# EAGLE schematic Tommy (EAGLE 6.3)
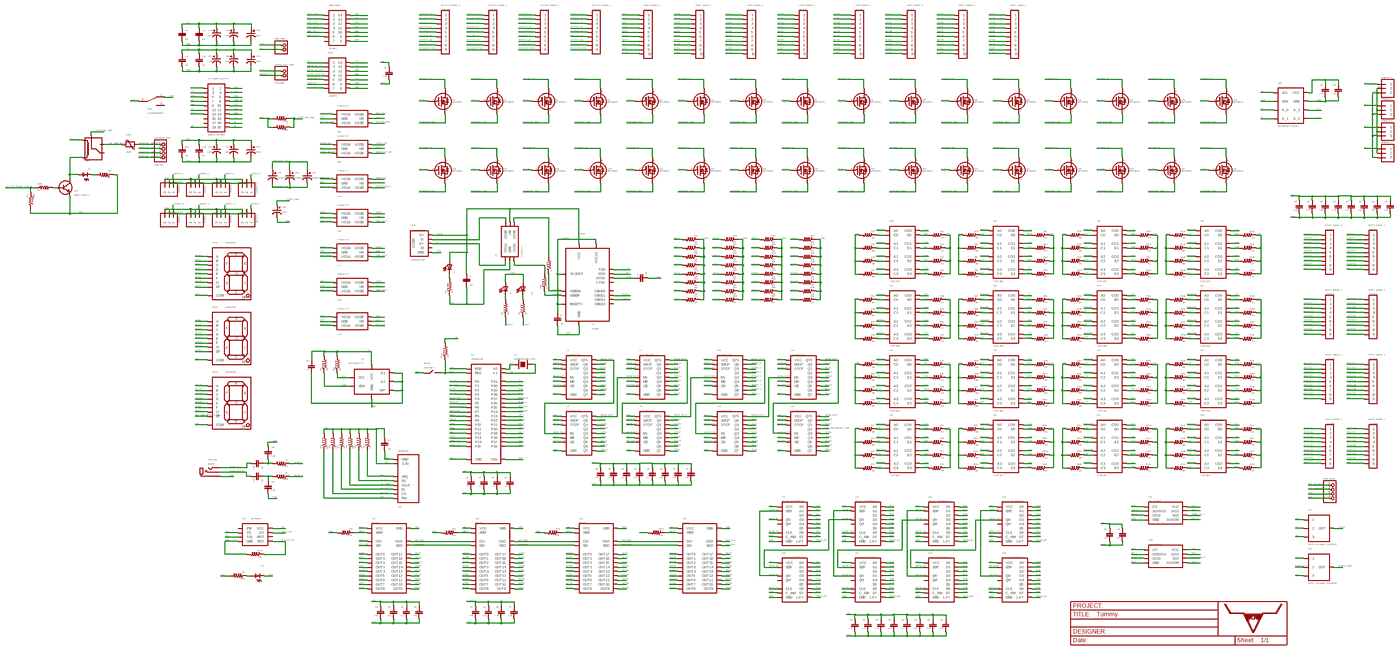
[diagram p0: schematic, sheet 1, overview]
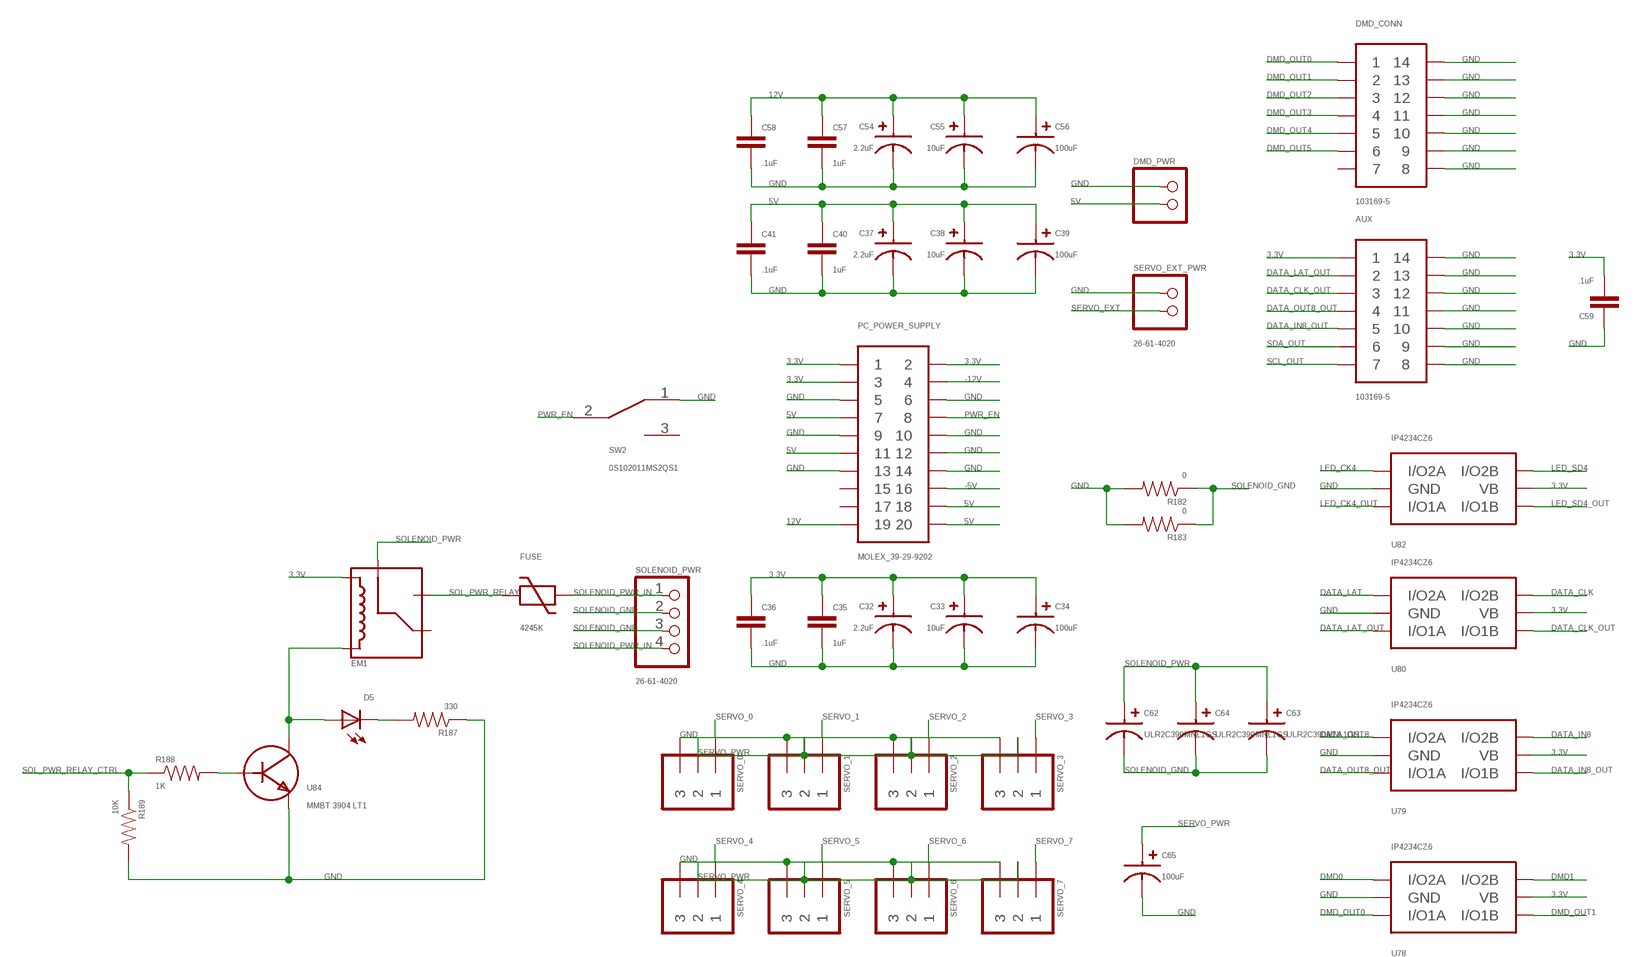
[diagram p1: schematic, sheet 1, part 1 of 9]
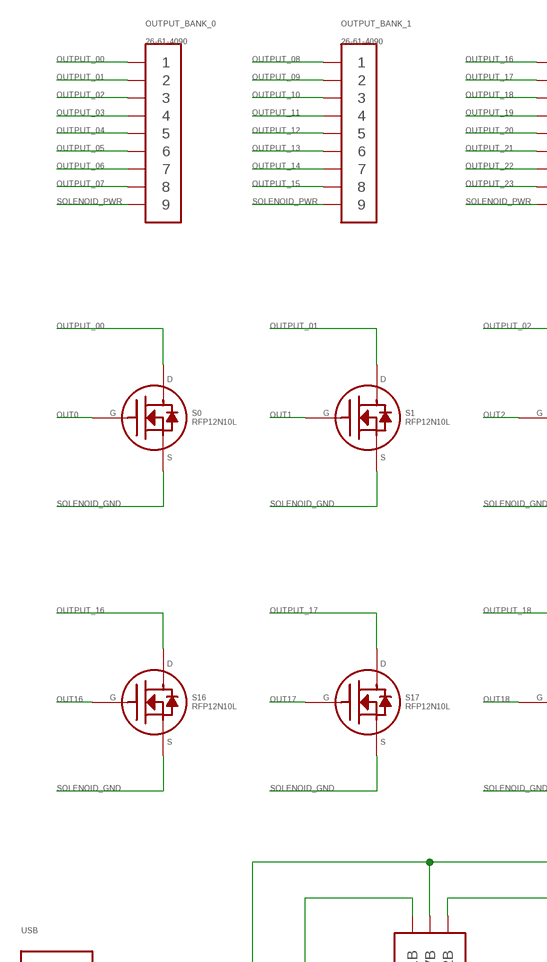
[diagram p2: schematic, sheet 1, part 2 of 9]
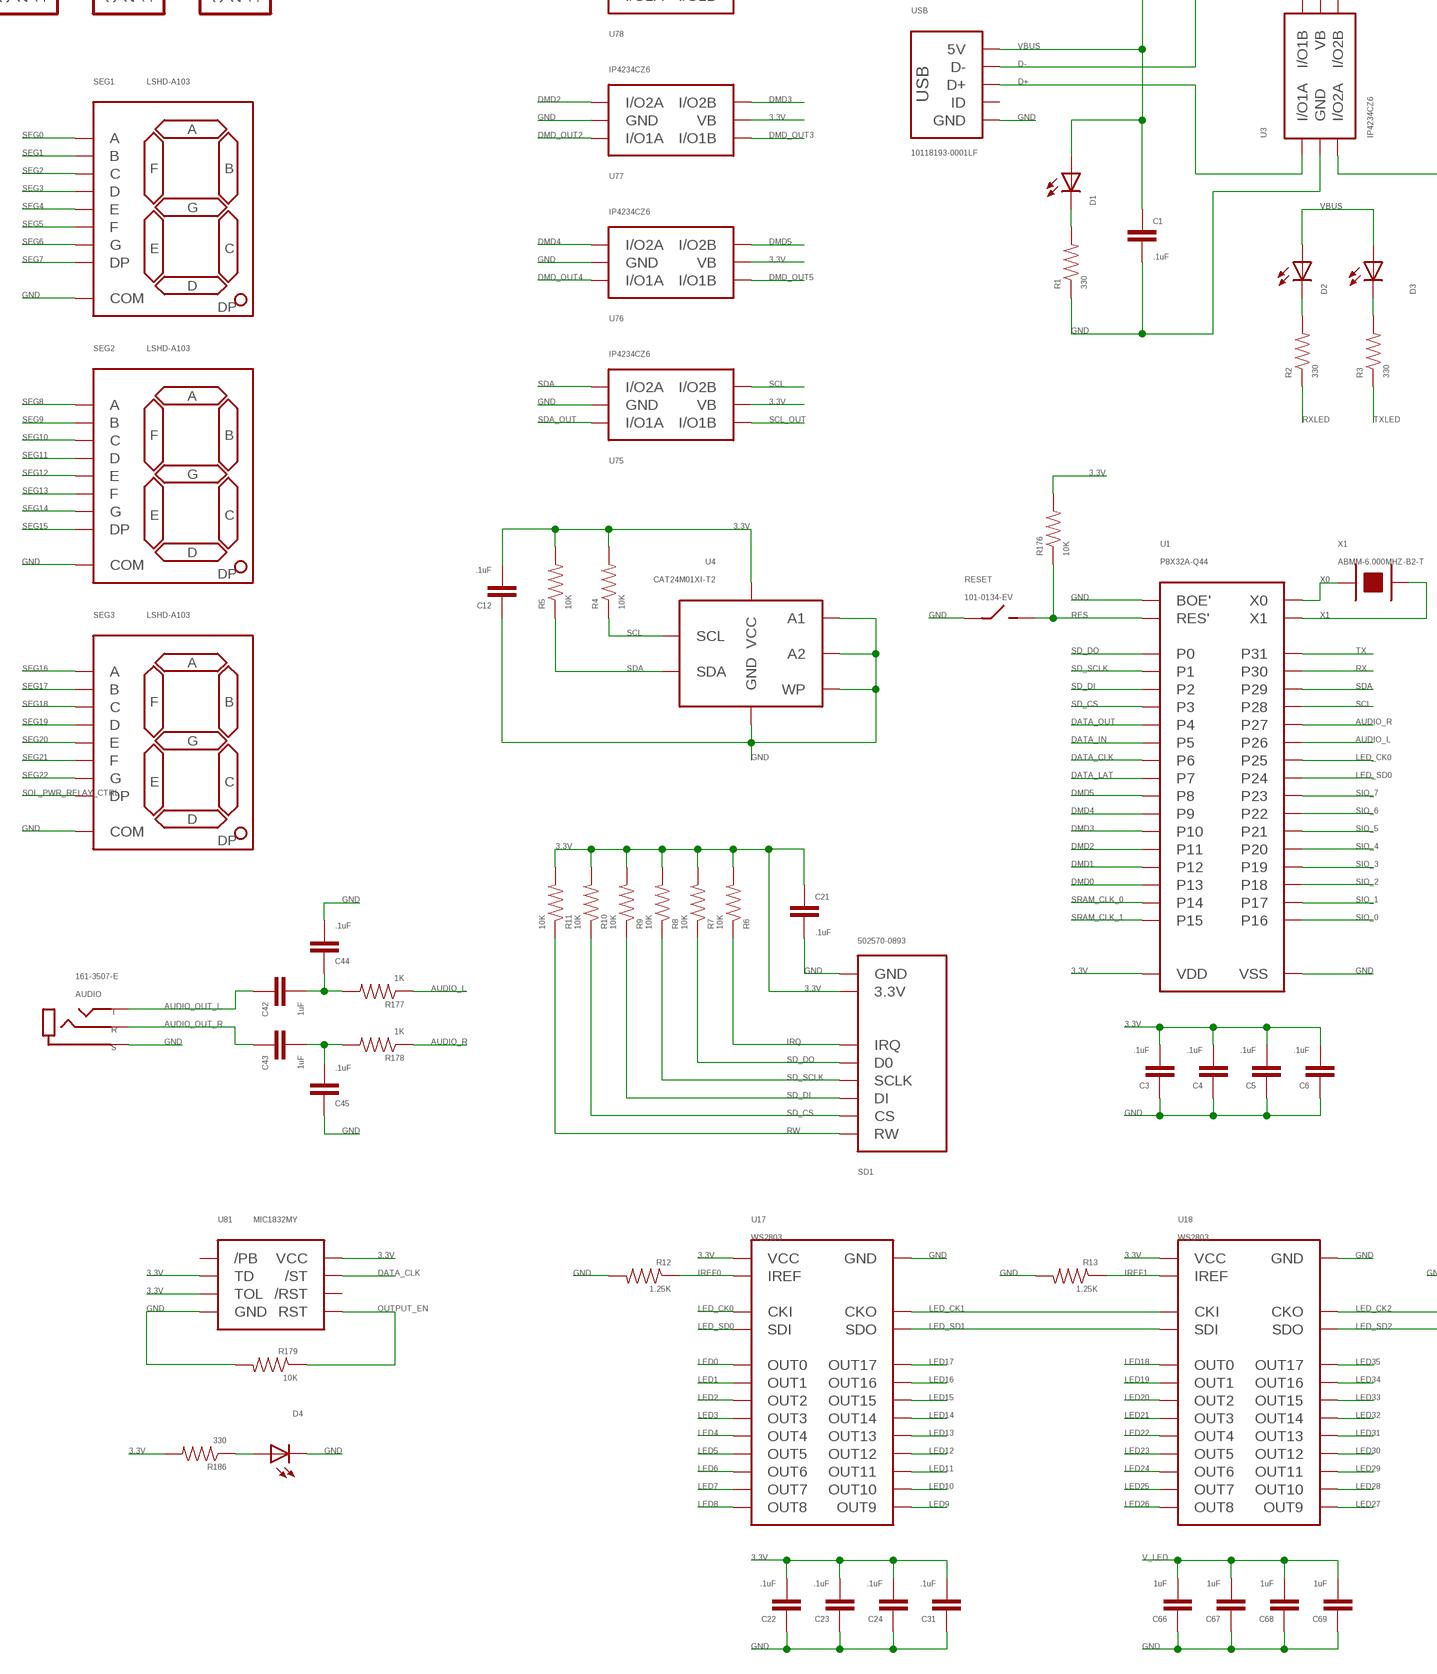
[diagram p3: schematic, sheet 1, part 3 of 9]
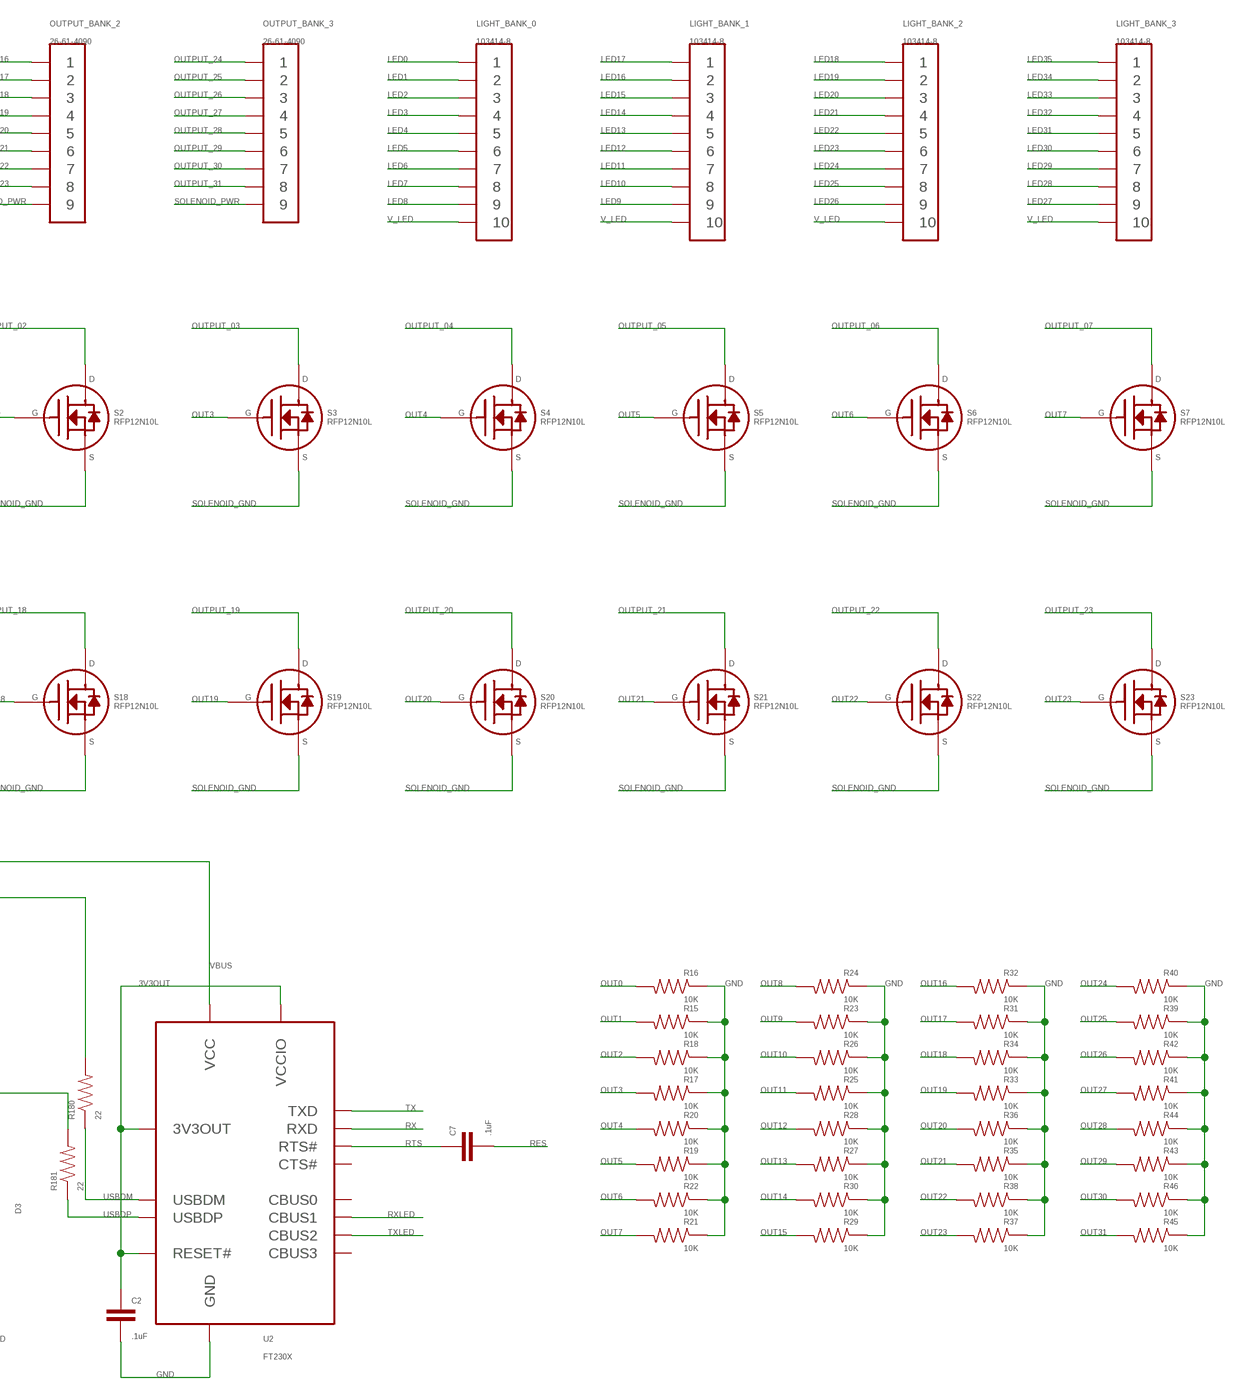
[diagram p4: schematic, sheet 1, part 4 of 9]
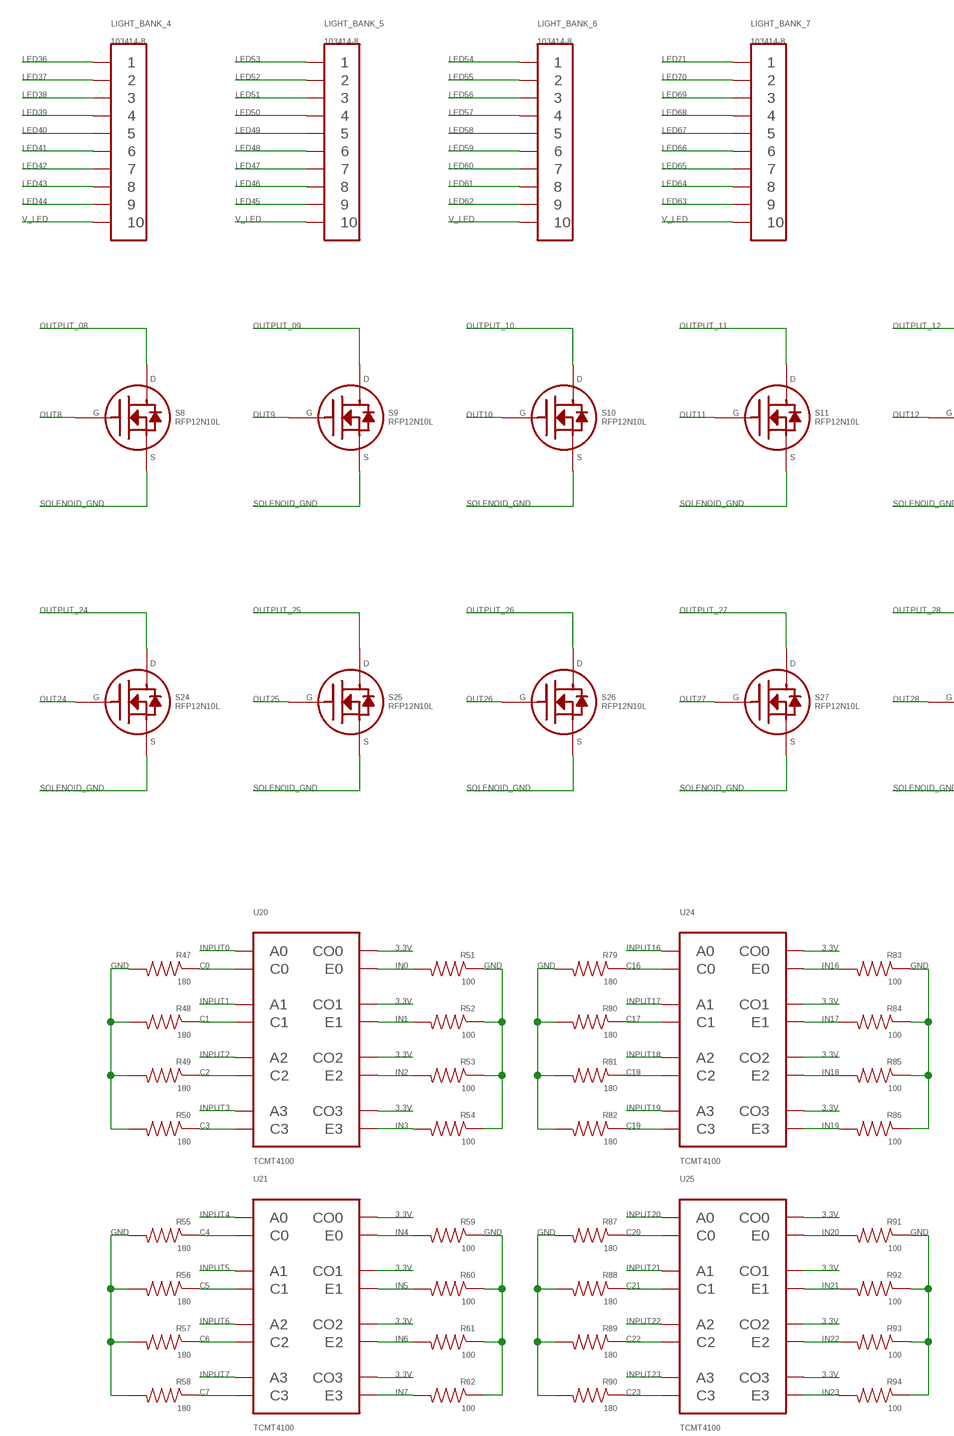
[diagram p5: schematic, sheet 1, part 5 of 9]
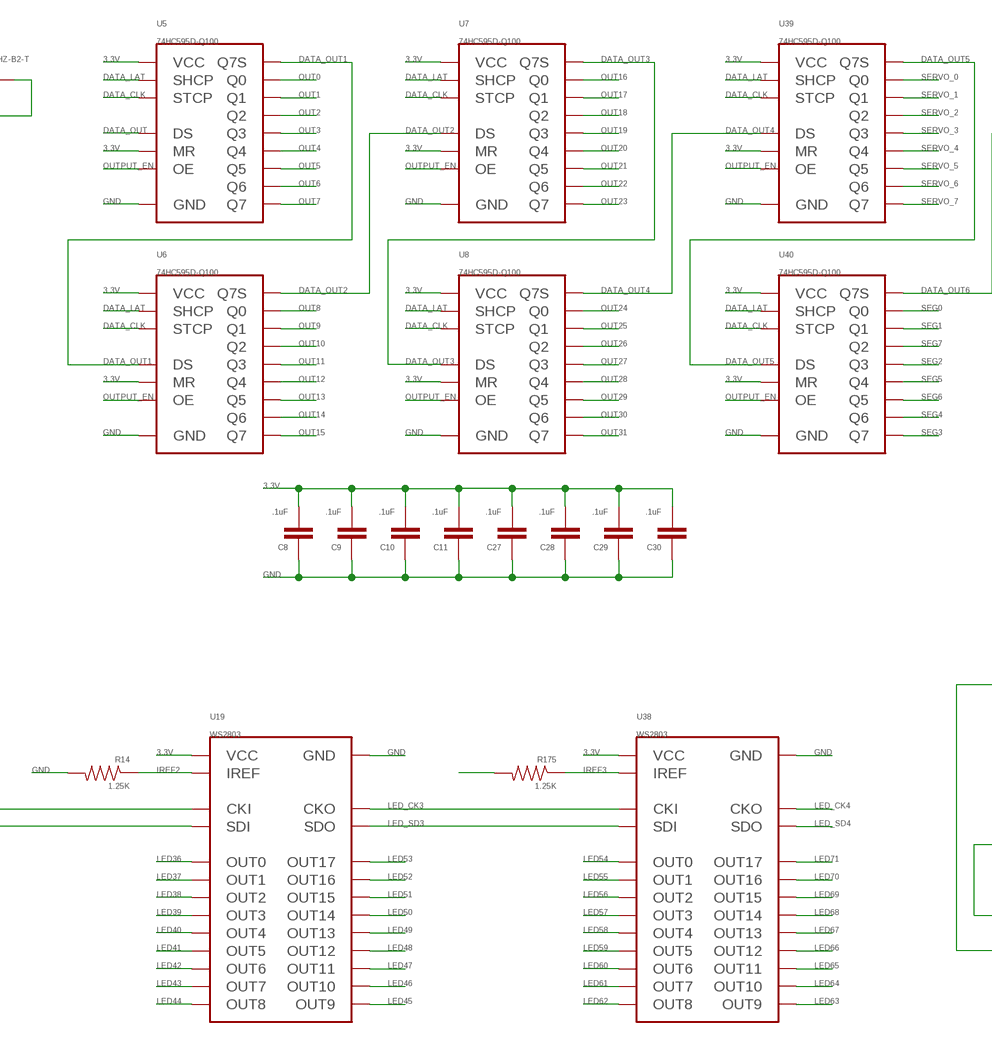
[diagram p6: schematic, sheet 1, part 6 of 9]
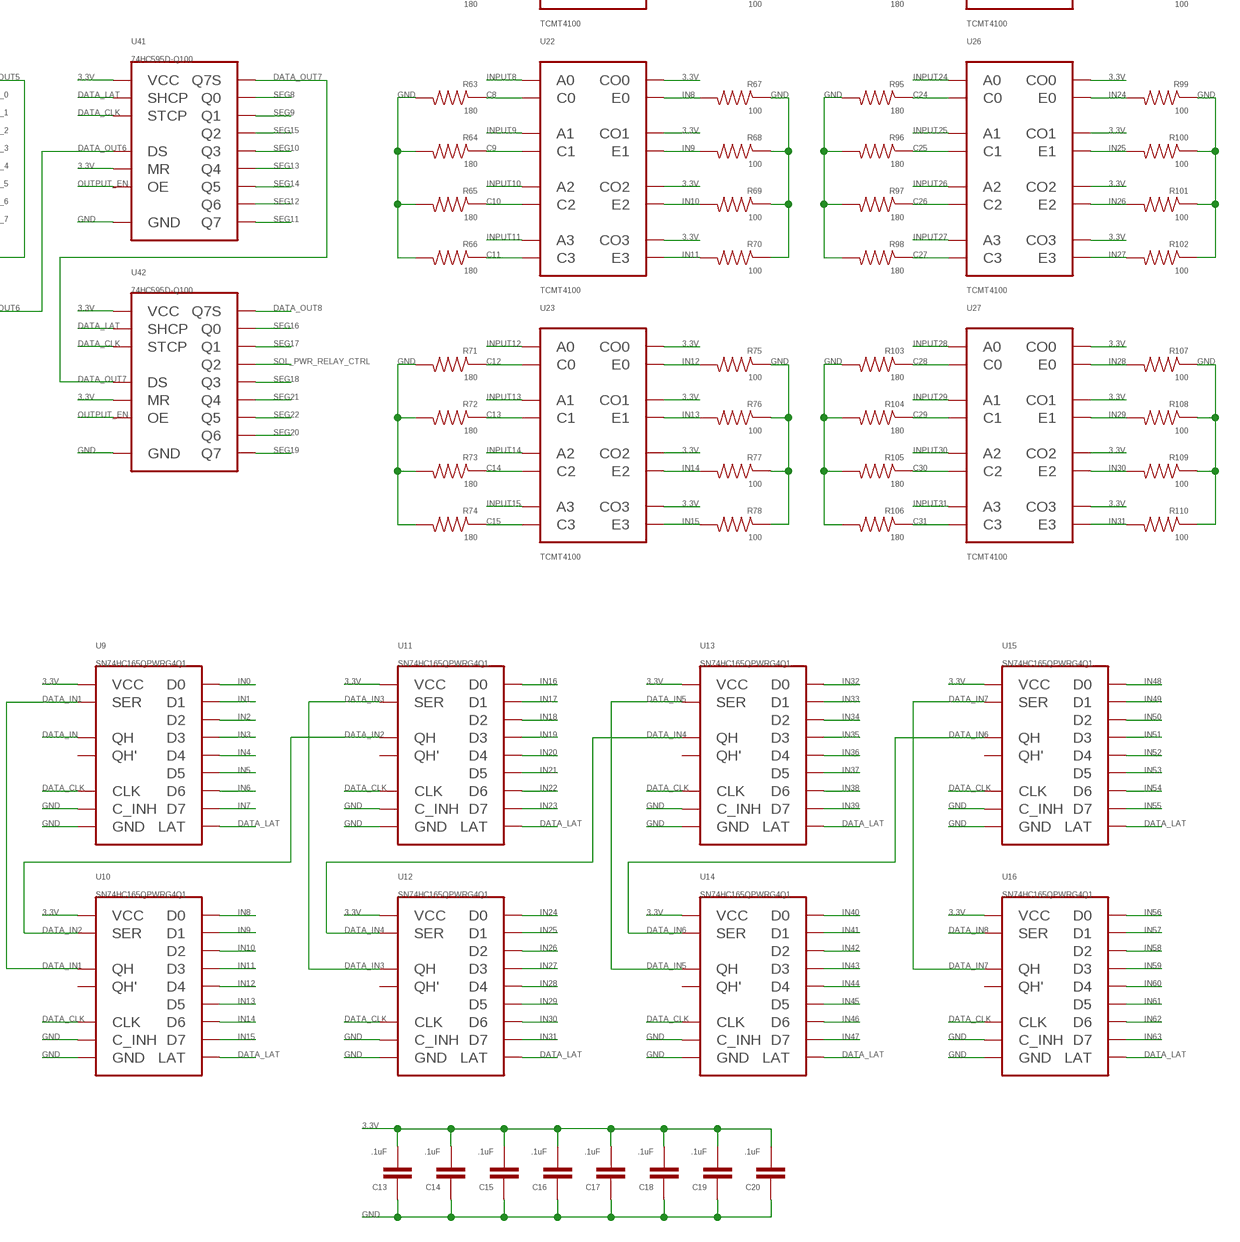
[diagram p7: schematic, sheet 1, part 7 of 9]
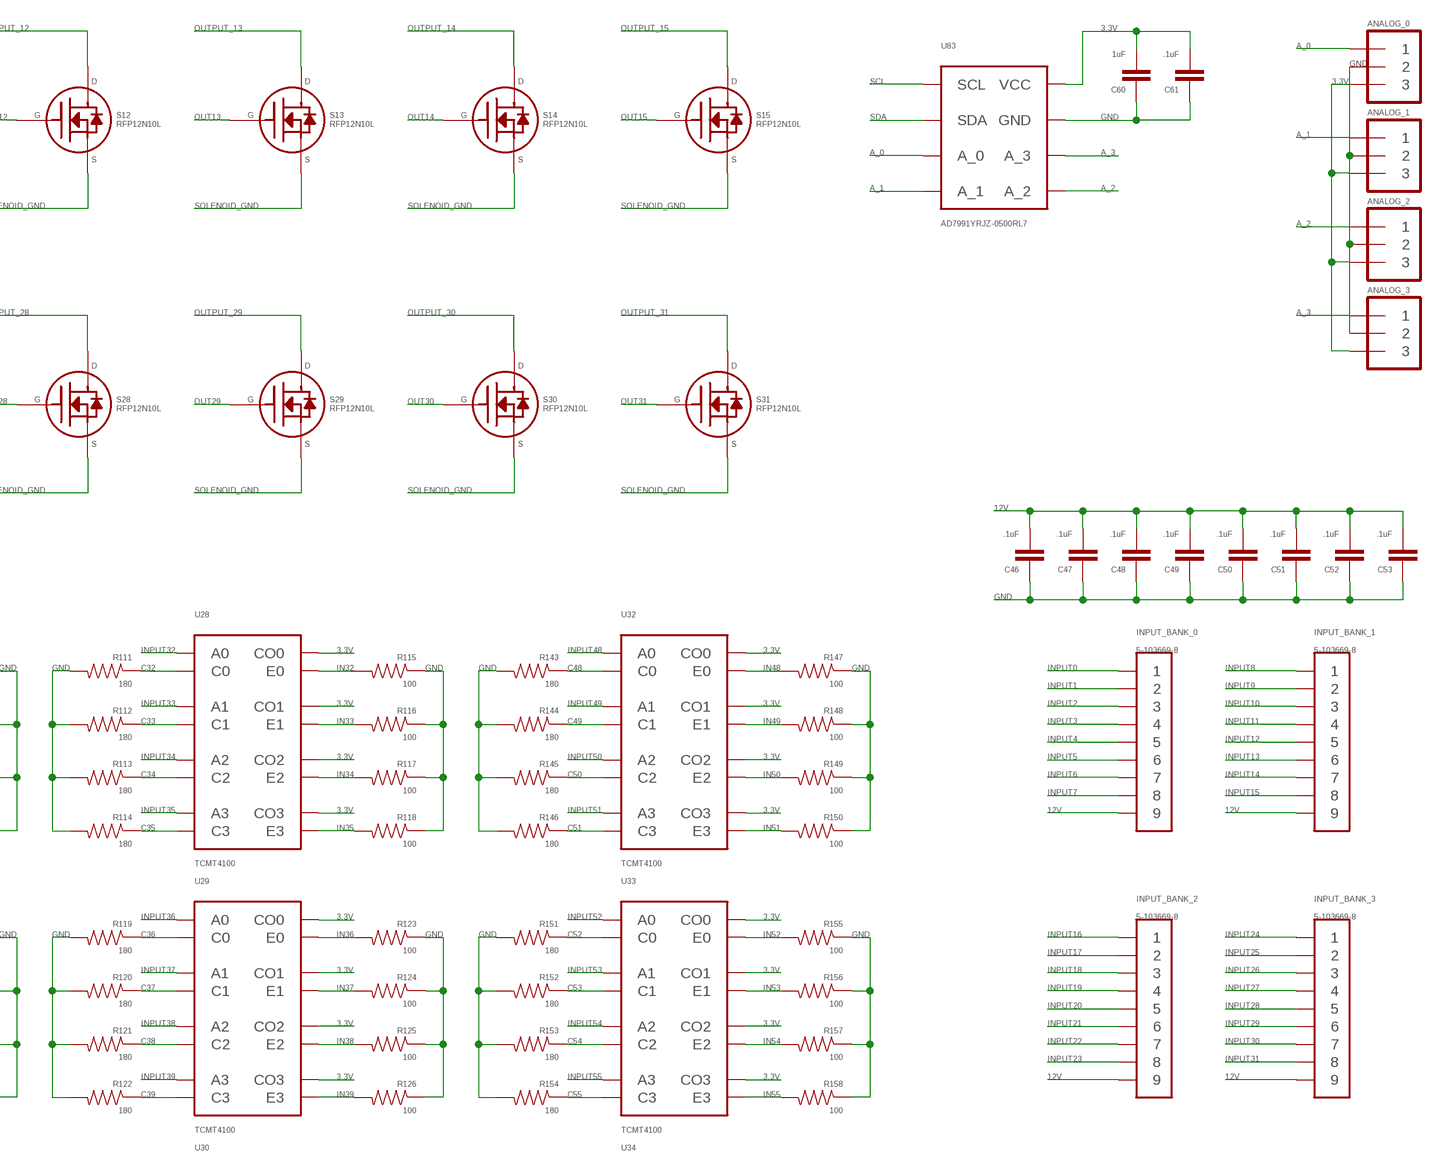
[diagram p8: schematic, sheet 1, part 8 of 9]
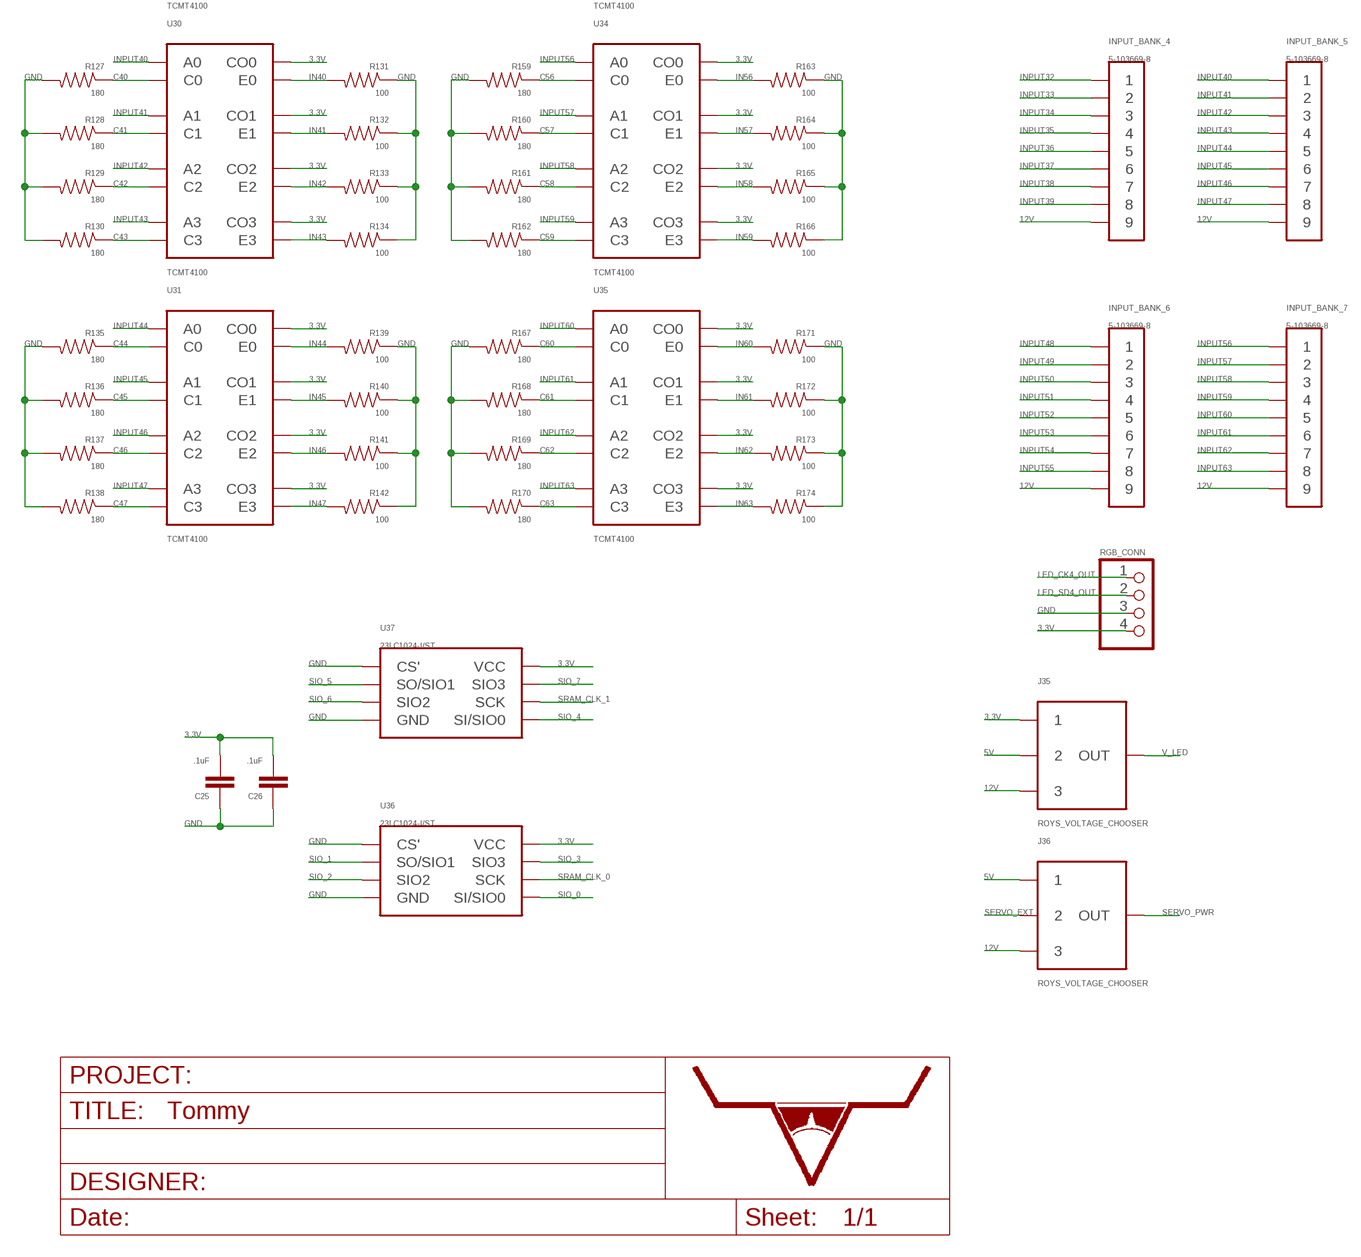
[diagram p9: schematic, sheet 1, part 9 of 9]

## Parts
ANALOG_0  PH_1X03HEADER_PTH  [HEADER_01X03_PTH]
ANALOG_1  PH_1X03HEADER_PTH  [HEADER_01X03_PTH]
ANALOG_2  PH_1X03HEADER_PTH  [HEADER_01X03_PTH]
ANALOG_3  PH_1X03HEADER_PTH  [HEADER_01X03_PTH]
AUDIO  161-3507-E  TRS_JACK161-3507-E  [161-3507-E]
AUX  103169-5  PH_2X07PTH  [HEADER_02X07_PTH]
C1  .1uF  CAPACITOR_NON_POLAR0402  [0402]
C2  .1uF  CAPACITOR_NON_POLAR0402  [0402]
C3  .1uF  CAPACITOR_NON_POLAR0402  [0402]
C4  .1uF  CAPACITOR_NON_POLAR0402  [0402]
C5  .1uF  CAPACITOR_NON_POLAR0402  [0402]
C6  .1uF  CAPACITOR_NON_POLAR0402  [0402]
C7  .1uF  CAPACITOR_NON_POLAR0402  [0402]
C8  .1uF  CAPACITOR_NON_POLAR0402  [0402]
C9  .1uF  CAPACITOR_NON_POLAR0402  [0402]
C10  .1uF  CAPACITOR_NON_POLAR0402  [0402]
C11  .1uF  CAPACITOR_NON_POLAR0402  [0402]
C12  .1uF  CAPACITOR_NON_POLAR0402  [0402]
C13  .1uF  CAPACITOR_NON_POLAR0402  [0402]
C14  .1uF  CAPACITOR_NON_POLAR0402  [0402]
C15  .1uF  CAPACITOR_NON_POLAR0402  [0402]
C16  .1uF  CAPACITOR_NON_POLAR0402  [0402]
C17  .1uF  CAPACITOR_NON_POLAR0402  [0402]
C18  .1uF  CAPACITOR_NON_POLAR0402  [0402]
C19  .1uF  CAPACITOR_NON_POLAR0402  [0402]
C20  .1uF  CAPACITOR_NON_POLAR0402  [0402]
C21  .1uF  CAPACITOR_NON_POLAR0402  [0402]
C22  .1uF  CAPACITOR_NON_POLAR0402  [0402]
C23  .1uF  CAPACITOR_NON_POLAR0402  [0402]
C24  .1uF  CAPACITOR_NON_POLAR0402  [0402]
C25  .1uF  CAPACITOR_NON_POLAR0402  [0402]
C26  .1uF  CAPACITOR_NON_POLAR0402  [0402]
C27  .1uF  CAPACITOR_NON_POLAR0402  [0402]
C28  .1uF  CAPACITOR_NON_POLAR0402  [0402]
C29  .1uF  CAPACITOR_NON_POLAR0402  [0402]
C30  .1uF  CAPACITOR_NON_POLAR0402  [0402]
C31  .1uF  CAPACITOR_NON_POLAR0402  [0402]
C32  2.2uF  CAPACITOR_POLARIZED1206  [1206_POLARIZED]
C33  10uF  CAPACITOR_POLARIZED1206  [1206_POLARIZED]
C34  100uF  CAPACITOR_POLARIZED6.3MM_SMD  [6.3MM_CAP_SMD]
C35  1uF  CAPACITOR_NON_POLAR0402  [0402]
C36  .1uF  CAPACITOR_NON_POLAR0402  [0402]
C37  2.2uF  CAPACITOR_POLARIZED1206  [1206_POLARIZED]
C38  10uF  CAPACITOR_POLARIZED1206  [1206_POLARIZED]
C39  100uF  CAPACITOR_POLARIZED6.3MM_SMD  [6.3MM_CAP_SMD]
C40  1uF  CAPACITOR_NON_POLAR0402  [0402]
C41  .1uF  CAPACITOR_NON_POLAR0402  [0402]
C42  1uF  CAPACITOR_NON_POLAR0402  [0402]
C43  1uF  CAPACITOR_NON_POLAR0402  [0402]
C44  .1uF  CAPACITOR_NON_POLAR0402  [0402]
C45  .1uF  CAPACITOR_NON_POLAR0402  [0402]
C46  .1uF  CAPACITOR_NON_POLAR0402  [0402]
C47  .1uF  CAPACITOR_NON_POLAR0402  [0402]
C48  .1uF  CAPACITOR_NON_POLAR0402  [0402]
C49  .1uF  CAPACITOR_NON_POLAR0402  [0402]
C50  .1uF  CAPACITOR_NON_POLAR0402  [0402]
C51  .1uF  CAPACITOR_NON_POLAR0402  [0402]
C52  .1uF  CAPACITOR_NON_POLAR0402  [0402]
C53  .1uF  CAPACITOR_NON_POLAR0402  [0402]
C54  2.2uF  CAPACITOR_POLARIZED1206  [1206_POLARIZED]
C55  10uF  CAPACITOR_POLARIZED1206  [1206_POLARIZED]
C56  100uF  CAPACITOR_POLARIZED6.3MM_SMD  [6.3MM_CAP_SMD]
C57  1uF  CAPACITOR_NON_POLAR0402  [0402]
C58  .1uF  CAPACITOR_NON_POLAR0402  [0402]
C59  .1uF  CAPACITOR_NON_POLAR0402  [0402]
C60  1uF  CAPACITOR_NON_POLAR0402  [0402]
C61  .1uF  CAPACITOR_NON_POLAR0402  [0402]
C62  ULR2C390MNL1GS  CAPACITOR_POLARIZEDEEH-ZA1V271P  [EEH-ZA1V271P]
C63  ULR2C390MNL1GS  CAPACITOR_POLARIZEDEEH-ZA1V271P  [EEH-ZA1V271P]
C64  ULR2C390MNL1GS  CAPACITOR_POLARIZEDEEH-ZA1V271P  [EEH-ZA1V271P]
C65  100uF  CAPACITOR_POLARIZED6.3MM_SMD  [6.3MM_CAP_SMD]
C66  1uF  CAPACITOR_NON_POLAR0402  [0402]
C67  1uF  CAPACITOR_NON_POLAR0402  [0402]
C68  1uF  CAPACITOR_NON_POLAR0402  [0402]
C69  1uF  CAPACITOR_NON_POLAR0402  [0402]
D1  LEDSML0603  [SML0603]
D2  LEDSML0603  [SML0603]
D3  LEDSML0603  [SML0603]
D4  LEDSML0603  [SML0603]
D5  LEDSML0603  [SML0603]
DMD_CONN  103169-5  PH_2X07PTH  [HEADER_02X07_PTH]
DMD_PWR  PH_1X02MOLEX_26-61-4020  [MOLEX_KK_2]
EM1  SPDT_RELAYG5LA  [G5LA_PCBRELAY_SPDT]
FUSE  4245K  PTC_FUSE4245K  [4245K]
INPUT_BANK_0  5-103669-8  PH_1X09PTH  [HEADER_01X09_PTH]
INPUT_BANK_1  5-103669-8  PH_1X09PTH  [HEADER_01X09_PTH]
INPUT_BANK_2  5-103669-8  PH_1X09PTH  [HEADER_01X09_PTH]
INPUT_BANK_3  5-103669-8  PH_1X09PTH  [HEADER_01X09_PTH]
INPUT_BANK_4  5-103669-8  PH_1X09PTH  [HEADER_01X09_PTH]
INPUT_BANK_5  5-103669-8  PH_1X09PTH  [HEADER_01X09_PTH]
INPUT_BANK_6  5-103669-8  PH_1X09PTH  [HEADER_01X09_PTH]
INPUT_BANK_7  5-103669-8  PH_1X09PTH  [HEADER_01X09_PTH]
J35  ROYS_VOLTAGE_CHOOSER  [ROYS_VOLTAGE_CHOOSER]
J36  ROYS_VOLTAGE_CHOOSER  [ROYS_VOLTAGE_CHOOSER]
LIGHT_BANK_0  103414-8  PH_1X10PTH  [HEADER_01X10_PTH]
LIGHT_BANK_1  103414-8  PH_1X10PTH  [HEADER_01X10_PTH]
LIGHT_BANK_2  103414-8  PH_1X10PTH  [HEADER_01X10_PTH]
LIGHT_BANK_3  103414-8  PH_1X10PTH  [HEADER_01X10_PTH]
LIGHT_BANK_4  103414-8  PH_1X10PTH  [HEADER_01X10_PTH]
LIGHT_BANK_5  103414-8  PH_1X10PTH  [HEADER_01X10_PTH]
LIGHT_BANK_6  103414-8  PH_1X10PTH  [HEADER_01X10_PTH]
LIGHT_BANK_7  103414-8  PH_1X10PTH  [HEADER_01X10_PTH]
OUTPUT_BANK_0  26-61-4090  PH_1X09MOLEX_KK_9  [MOLEX_KK_9]
OUTPUT_BANK_1  26-61-4090  PH_1X09MOLEX_KK_9  [MOLEX_KK_9]
OUTPUT_BANK_2  26-61-4090  PH_1X09MOLEX_KK_9  [MOLEX_KK_9]
OUTPUT_BANK_3  26-61-4090  PH_1X09MOLEX_KK_9  [MOLEX_KK_9]
PC_POWER_SUPPLY  MOLEX_39-29-9202  PH_2X10MOLEX_39-29-9202  [MOLEX_39-29-9202]
R1  330  RESISTOR0402  [0402]
R2  330  RESISTOR0402  [0402]
R3  330  RESISTOR0402  [0402]
R4  10K  RESISTOR0402  [0402]
R5  10K  RESISTOR0402  [0402]
R6  10K  RESISTOR0402  [0402]
R7  10K  RESISTOR0402  [0402]
R8  10K  RESISTOR0402  [0402]
R9  10K  RESISTOR0402  [0402]
R10  10K  RESISTOR0402  [0402]
R11  10K  RESISTOR0402  [0402]
R12  1.25K  RESISTOR0402  [0402]
R13  1.25K  RESISTOR0402  [0402]
R14  1.25K  RESISTOR0402  [0402]
R15  10K  RESISTOR0402  [0402]
R16  10K  RESISTOR0402  [0402]
R17  10K  RESISTOR0402  [0402]
R18  10K  RESISTOR0402  [0402]
R19  10K  RESISTOR0402  [0402]
R20  10K  RESISTOR0402  [0402]
R21  10K  RESISTOR0402  [0402]
R22  10K  RESISTOR0402  [0402]
R23  10K  RESISTOR0402  [0402]
R24  10K  RESISTOR0402  [0402]
R25  10K  RESISTOR0402  [0402]
R26  10K  RESISTOR0402  [0402]
R27  10K  RESISTOR0402  [0402]
R28  10K  RESISTOR0402  [0402]
R29  10K  RESISTOR0402  [0402]
R30  10K  RESISTOR0402  [0402]
R31  10K  RESISTOR0402  [0402]
R32  10K  RESISTOR0402  [0402]
R33  10K  RESISTOR0402  [0402]
R34  10K  RESISTOR0402  [0402]
R35  10K  RESISTOR0402  [0402]
R36  10K  RESISTOR0402  [0402]
R37  10K  RESISTOR0402  [0402]
R38  10K  RESISTOR0402  [0402]
R39  10K  RESISTOR0402  [0402]
R40  10K  RESISTOR0402  [0402]
R41  10K  RESISTOR0402  [0402]
R42  10K  RESISTOR0402  [0402]
R43  10K  RESISTOR0402  [0402]
R44  10K  RESISTOR0402  [0402]
R45  10K  RESISTOR0402  [0402]
R46  10K  RESISTOR0402  [0402]
R47  180  RESISTOR0402  [0402]
R48  180  RESISTOR0402  [0402]
R49  180  RESISTOR0402  [0402]
R50  180  RESISTOR0402  [0402]
R51  100  RESISTOR0402  [0402]
R52  100  RESISTOR0402  [0402]
R53  100  RESISTOR0402  [0402]
R54  100  RESISTOR0402  [0402]
R55  180  RESISTOR0402  [0402]
R56  180  RESISTOR0402  [0402]
R57  180  RESISTOR0402  [0402]
R58  180  RESISTOR0402  [0402]
R59  100  RESISTOR0402  [0402]
R60  100  RESISTOR0402  [0402]
R61  100  RESISTOR0402  [0402]
R62  100  RESISTOR0402  [0402]
R63  180  RESISTOR0402  [0402]
R64  180  RESISTOR0402  [0402]
R65  180  RESISTOR0402  [0402]
R66  180  RESISTOR0402  [0402]
R67  100  RESISTOR0402  [0402]
R68  100  RESISTOR0402  [0402]
R69  100  RESISTOR0402  [0402]
R70  100  RESISTOR0402  [0402]
R71  180  RESISTOR0402  [0402]
R72  180  RESISTOR0402  [0402]
R73  180  RESISTOR0402  [0402]
R74  180  RESISTOR0402  [0402]
R75  100  RESISTOR0402  [0402]
R76  100  RESISTOR0402  [0402]
R77  100  RESISTOR0402  [0402]
R78  100  RESISTOR0402  [0402]
R79  180  RESISTOR0402  [0402]
R80  180  RESISTOR0402  [0402]
R81  180  RESISTOR0402  [0402]
R82  180  RESISTOR0402  [0402]
R83  100  RESISTOR0402  [0402]
R84  100  RESISTOR0402  [0402]
R85  100  RESISTOR0402  [0402]
R86  100  RESISTOR0402  [0402]
R87  180  RESISTOR0402  [0402]
R88  180  RESISTOR0402  [0402]
R89  180  RESISTOR0402  [0402]
R90  180  RESISTOR0402  [0402]
R91  100  RESISTOR0402  [0402]
R92  100  RESISTOR0402  [0402]
R93  100  RESISTOR0402  [0402]
R94  100  RESISTOR0402  [0402]
R95  180  RESISTOR0402  [0402]
R96  180  RESISTOR0402  [0402]
R97  180  RESISTOR0402  [0402]
R98  180  RESISTOR0402  [0402]
R99  100  RESISTOR0402  [0402]
R100  100  RESISTOR0402  [0402]
R101  100  RESISTOR0402  [0402]
R102  100  RESISTOR0402  [0402]
R103  180  RESISTOR0402  [0402]
R104  180  RESISTOR0402  [0402]
R105  180  RESISTOR0402  [0402]
R106  180  RESISTOR0402  [0402]
R107  100  RESISTOR0402  [0402]
R108  100  RESISTOR0402  [0402]
R109  100  RESISTOR0402  [0402]
R110  100  RESISTOR0402  [0402]
R111  180  RESISTOR0402  [0402]
R112  180  RESISTOR0402  [0402]
R113  180  RESISTOR0402  [0402]
R114  180  RESISTOR0402  [0402]
R115  100  RESISTOR0402  [0402]
R116  100  RESISTOR0402  [0402]
R117  100  RESISTOR0402  [0402]
R118  100  RESISTOR0402  [0402]
R119  180  RESISTOR0402  [0402]
R120  180  RESISTOR0402  [0402]
R121  180  RESISTOR0402  [0402]
R122  180  RESISTOR0402  [0402]
R123  100  RESISTOR0402  [0402]
R124  100  RESISTOR0402  [0402]
R125  100  RESISTOR0402  [0402]
R126  100  RESISTOR0402  [0402]
R127  180  RESISTOR0402  [0402]
R128  180  RESISTOR0402  [0402]
R129  180  RESISTOR0402  [0402]
R130  180  RESISTOR0402  [0402]
R131  100  RESISTOR0402  [0402]
R132  100  RESISTOR0402  [0402]
R133  100  RESISTOR0402  [0402]
R134  100  RESISTOR0402  [0402]
R135  180  RESISTOR0402  [0402]
R136  180  RESISTOR0402  [0402]
R137  180  RESISTOR0402  [0402]
R138  180  RESISTOR0402  [0402]
R139  100  RESISTOR0402  [0402]
R140  100  RESISTOR0402  [0402]
R141  100  RESISTOR0402  [0402]
R142  100  RESISTOR0402  [0402]
R143  180  RESISTOR0402  [0402]
R144  180  RESISTOR0402  [0402]
R145  180  RESISTOR0402  [0402]
R146  180  RESISTOR0402  [0402]
R147  100  RESISTOR0402  [0402]
R148  100  RESISTOR0402  [0402]
R149  100  RESISTOR0402  [0402]
R150  100  RESISTOR0402  [0402]
R151  180  RESISTOR0402  [0402]
R152  180  RESISTOR0402  [0402]
R153  180  RESISTOR0402  [0402]
R154  180  RESISTOR0402  [0402]
R155  100  RESISTOR0402  [0402]
R156  100  RESISTOR0402  [0402]
R157  100  RESISTOR0402  [0402]
R158  100  RESISTOR0402  [0402]
R159  180  RESISTOR0402  [0402]
R160  180  RESISTOR0402  [0402]
R161  180  RESISTOR0402  [0402]
R162  180  RESISTOR0402  [0402]
R163  100  RESISTOR0402  [0402]
R164  100  RESISTOR0402  [0402]
R165  100  RESISTOR0402  [0402]
R166  100  RESISTOR0402  [0402]
R167  180  RESISTOR0402  [0402]
R168  180  RESISTOR0402  [0402]
R169  180  RESISTOR0402  [0402]
R170  180  RESISTOR0402  [0402]
R171  100  RESISTOR0402  [0402]
R172  100  RESISTOR0402  [0402]
R173  100  RESISTOR0402  [0402]
R174  100  RESISTOR0402  [0402]
R175  1.25K  RESISTOR0402  [0402]
R176  10K  RESISTOR0402  [0402]
R177  1K  RESISTOR0402  [0402]
R178  1K  RESISTOR0402  [0402]
R179  10K  RESISTOR0402  [0402]
R180  22  RESISTOR0402  [0402]
R181  22  RESISTOR0402  [0402]
R182  0  RESISTOR0402  [0402]
R183  0  RESISTOR0402  [0402]
R186  330  RESISTOR0402  [0402]
R187  330  RESISTOR0402  [0402]
R188  1K  RESISTOR0402  [0402]
R189  10K  RESISTOR0402  [0402]
RESET  101-0134-EV  SPST101-0134-EV  [101-0134-EV]
RGB_CONN  PH_1X04HEADER_PTH_ROUND  [HEADER_01X04_PTH_ROUND]
S0  RFP12N10L  MOSFET_N-CHANNEL_SINGLETO-220AB  [TO-220AB]
S1  RFP12N10L  MOSFET_N-CHANNEL_SINGLETO-220AB  [TO-220AB]
S2  RFP12N10L  MOSFET_N-CHANNEL_SINGLETO-220AB  [TO-220AB]
S3  RFP12N10L  MOSFET_N-CHANNEL_SINGLETO-220AB  [TO-220AB]
S4  RFP12N10L  MOSFET_N-CHANNEL_SINGLETO-220AB  [TO-220AB]
S5  RFP12N10L  MOSFET_N-CHANNEL_SINGLETO-220AB  [TO-220AB]
S6  RFP12N10L  MOSFET_N-CHANNEL_SINGLETO-220AB  [TO-220AB]
S7  RFP12N10L  MOSFET_N-CHANNEL_SINGLETO-220AB  [TO-220AB]
S8  RFP12N10L  MOSFET_N-CHANNEL_SINGLETO-220AB  [TO-220AB]
S9  RFP12N10L  MOSFET_N-CHANNEL_SINGLETO-220AB  [TO-220AB]
S10  RFP12N10L  MOSFET_N-CHANNEL_SINGLETO-220AB  [TO-220AB]
S11  RFP12N10L  MOSFET_N-CHANNEL_SINGLETO-220AB  [TO-220AB]
S12  RFP12N10L  MOSFET_N-CHANNEL_SINGLETO-220AB  [TO-220AB]
S13  RFP12N10L  MOSFET_N-CHANNEL_SINGLETO-220AB  [TO-220AB]
S14  RFP12N10L  MOSFET_N-CHANNEL_SINGLETO-220AB  [TO-220AB]
S15  RFP12N10L  MOSFET_N-CHANNEL_SINGLETO-220AB  [TO-220AB]
S16  RFP12N10L  MOSFET_N-CHANNEL_SINGLETO-220AB  [TO-220AB]
S17  RFP12N10L  MOSFET_N-CHANNEL_SINGLETO-220AB  [TO-220AB]
S18  RFP12N10L  MOSFET_N-CHANNEL_SINGLETO-220AB  [TO-220AB]
S19  RFP12N10L  MOSFET_N-CHANNEL_SINGLETO-220AB  [TO-220AB]
S20  RFP12N10L  MOSFET_N-CHANNEL_SINGLETO-220AB  [TO-220AB]
S21  RFP12N10L  MOSFET_N-CHANNEL_SINGLETO-220AB  [TO-220AB]
S22  RFP12N10L  MOSFET_N-CHANNEL_SINGLETO-220AB  [TO-220AB]
S23  RFP12N10L  MOSFET_N-CHANNEL_SINGLETO-220AB  [TO-220AB]
S24  RFP12N10L  MOSFET_N-CHANNEL_SINGLETO-220AB  [TO-220AB]
S25  RFP12N10L  MOSFET_N-CHANNEL_SINGLETO-220AB  [TO-220AB]
S26  RFP12N10L  MOSFET_N-CHANNEL_SINGLETO-220AB  [TO-220AB]
S27  RFP12N10L  MOSFET_N-CHANNEL_SINGLETO-220AB  [TO-220AB]
S28  RFP12N10L  MOSFET_N-CHANNEL_SINGLETO-220AB  [TO-220AB]
S29  RFP12N10L  MOSFET_N-CHANNEL_SINGLETO-220AB  [TO-220AB]
S30  RFP12N10L  MOSFET_N-CHANNEL_SINGLETO-220AB  [TO-220AB]
S31  RFP12N10L  MOSFET_N-CHANNEL_SINGLETO-220AB  [TO-220AB]
SD1  502570-0893  SD_CARD502570-0893  [502570-0893]
SEG1  LSHD-A103  7-SEGMENT_SINGLELSHD-A103  [LSHD-A103]
SEG2  LSHD-A103  7-SEGMENT_SINGLELSHD-A103  [LSHD-A103]
SEG3  LSHD-A103  7-SEGMENT_SINGLELSHD-A103  [LSHD-A103]
SERVO_0  PH_1X03HEADER_PTH  [HEADER_01X03_PTH]
SERVO_1  PH_1X03HEADER_PTH  [HEADER_01X03_PTH]
SERVO_2  PH_1X03HEADER_PTH  [HEADER_01X03_PTH]
SERVO_3  PH_1X03HEADER_PTH  [HEADER_01X03_PTH]
SERVO_4  PH_1X03HEADER_PTH  [HEADER_01X03_PTH]
SERVO_5  PH_1X03HEADER_PTH  [HEADER_01X03_PTH]
SERVO_6  PH_1X03HEADER_PTH  [HEADER_01X03_PTH]
SERVO_7  PH_1X03HEADER_PTH  [HEADER_01X03_PTH]
SERVO_EXT_PWR  26-61-4020  PH_1X02MOLEX_26-61-4020  [MOLEX_KK_2]
SOLENOID_PWR  26-61-4020  PH_1X04KK_4  [MOLEX_KK_4]
SW2  0S102011MS2QS1  SPDT0S102011MS2QS1  [0S102011MS2QS1]
U1  P8X32A-Q44  P8X32A_PROPELLERLQFP-44  [LQFP-44]
U2  FT230X  FT230XSSOP-16  [SSOP-16]
U3  IP4234CZ6  IP4234CZ6SOT-457  [SOT-457]
U4  CAT24M01XI-T2  CAT24M01XI-T2SOIC-8_W  [SOIC-8_W]
U5  74HC595D-Q100  74HC595TTSOP-16  [TTSOP-16]
U6  74HC595D-Q100  74HC595TTSOP-16  [TTSOP-16]
U7  74HC595D-Q100  74HC595TTSOP-16  [TTSOP-16]
U8  74HC595D-Q100  74HC595TTSOP-16  [TTSOP-16]
U9  SN74HC165QPWRG4Q1  74HC165TTSOP-16  [TTSOP-16]
U10  SN74HC165QPWRG4Q1  74HC165TTSOP-16  [TTSOP-16]
U11  SN74HC165QPWRG4Q1  74HC165TTSOP-16  [TTSOP-16]
U12  SN74HC165QPWRG4Q1  74HC165TTSOP-16  [TTSOP-16]
U13  SN74HC165QPWRG4Q1  74HC165TTSOP-16  [TTSOP-16]
U14  SN74HC165QPWRG4Q1  74HC165TTSOP-16  [TTSOP-16]
U15  SN74HC165QPWRG4Q1  74HC165TTSOP-16  [TTSOP-16]
U16  SN74HC165QPWRG4Q1  74HC165TTSOP-16  [TTSOP-16]
U17  WS2803  WS2803SOP-28  [SOP-28]
U18  WS2803  WS2803SOP-28  [SOP-28]
U19  WS2803  WS2803SOP-28  [SOP-28]
U20  TCMT4100  TCMT4100SOP-16  [SOP-16]
U21  TCMT4100  TCMT4100SOP-16  [SOP-16]
U22  TCMT4100  TCMT4100SOP-16  [SOP-16]
U23  TCMT4100  TCMT4100SOP-16  [SOP-16]
U24  TCMT4100  TCMT4100SOP-16  [SOP-16]
U25  TCMT4100  TCMT4100SOP-16  [SOP-16]
U26  TCMT4100  TCMT4100SOP-16  [SOP-16]
U27  TCMT4100  TCMT4100SOP-16  [SOP-16]
U28  TCMT4100  TCMT4100SOP-16  [SOP-16]
U29  TCMT4100  TCMT4100SOP-16  [SOP-16]
U30  TCMT4100  TCMT4100SOP-16  [SOP-16]
U31  TCMT4100  TCMT4100SOP-16  [SOP-16]
U32  TCMT4100  TCMT4100SOP-16  [SOP-16]
U33  TCMT4100  TCMT4100SOP-16  [SOP-16]
U34  TCMT4100  TCMT4100SOP-16  [SOP-16]
U35  TCMT4100  TCMT4100SOP-16  [SOP-16]
U36  23LC1024-I/ST  23A1024/23LC1024TTSOP-8  [TTSOP-8]
U37  23LC1024-I/ST  23A1024/23LC1024TTSOP-8  [TTSOP-8]
U38  WS2803  WS2803SOP-28  [SOP-28]
U39  74HC595D-Q100  74HC595TTSOP-16  [TTSOP-16]
U40  74HC595D-Q100  74HC595TTSOP-16  [TTSOP-16]
U41  74HC595D-Q100  74HC595TTSOP-16  [TTSOP-16]
U42  74HC595D-Q100  74HC595TTSOP-16  [TTSOP-16]
U75  IP4234CZ6  IP4234CZ6SOT-457  [SOT-457]
U76  IP4234CZ6  IP4234CZ6SOT-457  [SOT-457]
U77  IP4234CZ6  IP4234CZ6SOT-457  [SOT-457]
U78  IP4234CZ6  IP4234CZ6SOT-457  [SOT-457]
U79  IP4234CZ6  IP4234CZ6SOT-457  [SOT-457]
U80  IP4234CZ6  IP4234CZ6SOT-457  [SOT-457]
U81  MIC1832MY  MIC1232MYSOIC-8  [SOIC-8]
U82  IP4234CZ6  IP4234CZ6SOT-457  [SOT-457]
U83  AD7991YRJZ-0500RL7  AD799XSOT-23-8  [SOT-23-8]
U84  MMBT 3904 LT1  BJT_NPN_SINGLESOT-23  [SOT-23]
U$1  LHE_FRAME  [LHE_FRAME]
USB  10118193-0001LF  USB10118193-0001LF  [10118193-0001LF]
X1  ABMM-6.000MHZ-B2-T  CRYSTAL7MM_X_5MM  [7MM_X_5MM]

## Nets
3.3V: ANALOG_0.3 ANALOG_1.3 ANALOG_2.3 ANALOG_3.3 AUX.1 C3.2 C4.2 C5.2 C6.2 C8.2 C9.2 C10.2 C11.2 C12.2 C13.2 C14.2 C15.2 C16.2 C17.2 C18.2 C19.2 C20.2 C21.1 C22.2 C23.2 C24.2 C25.2 C26.2 C27.2 C28.2 C29.2 C30.2 C31.2 C32.+(POS) C33.+(POS) C34.POS C35.1 C36.1 C59.2 C60.2 C61.2 EM1.2 J35.1 PC_POWER_SUPPLY.1 PC_POWER_SUPPLY.2 PC_POWER_SUPPLY.3 R4.2 R5.2 R6.2 R7.2 R8.2 R9.2 R10.2 R11.2 R176.2 R186.2 RGB_CONN.4 SD1.5(3.3V) U1.8(VDD) U1.18(VDD) U1.30(VDD) U1.40(VDD) U4.8(VCC) U5.10(MR) U5.16(VCC) U6.10(MR) U6.16(VCC) U7.10(MR) U7.16(VCC) U8.10(MR) U8.16(VCC) U9.16(VCC) U10.16(VCC) U11.16(VCC) U12.16(VCC) U13.16(VCC) U14.16(VCC) U15.16(VCC) U16.16(VCC) U17.28(VCC) U18.28(VCC) U19.28(VCC) U20.10(CO3) U20.12(CO2) U20.14(CO1) U20.16(CO0) U21.10(CO3) U21.12(CO2) U21.14(CO1) U21.16(CO0) U22.10(CO3) U22.12(CO2) U22.14(CO1) U22.16(CO0) U23.10(CO3) U23.12(CO2) U23.14(CO1) U23.16(CO0) U24.10(CO3) U24.12(CO2) U24.14(CO1) U24.16(CO0) U25.10(CO3) U25.12(CO2) U25.14(CO1) U25.16(CO0) U26.10(CO3) U26.12(CO2) U26.14(CO1) U26.16(CO0) U27.10(CO3) U27.12(CO2) U27.14(CO1) U27.16(CO0) U28.10(CO3) U28.12(CO2) U28.14(CO1) U28.16(CO0) U29.10(CO3) U29.12(CO2) U29.14(CO1) U29.16(CO0) U30.10(CO3) U30.12(CO2) U30.14(CO1) U30.16(CO0) U31.10(CO3) U31.12(CO2) U31.14(CO1) U31.16(CO0) U32.10(CO3) U32.12(CO2) U32.14(CO1) U32.16(CO0) U33.10(CO3) U33.12(CO2) U33.14(CO1) U33.16(CO0) U34.10(CO3) U34.12(CO2) U34.14(CO1) U34.16(CO0) U35.10(CO3) U35.12(CO2) U35.14(CO1) U35.16(CO0) U36.8(VCC) U37.8(VCC) U38.28(VCC) U39.10(MR) U39.16(VCC) U40.10(MR) U40.16(VCC) U41.10(MR) U41.16(VCC) U42.10(MR) U42.16(VCC) U75.5(VB) U76.5(VB) U77.5(VB) U78.5(VB) U79.5(VB) U80.5(VB) U81.2(TD) U81.3(TOL) U81.8(VCC) U82.5(VB) U83.8(VCC)
3V3OUT: C2.1 U2.3(VCCIO) U2.10(3V3OUT) U2.11(RESET#)
5V: C37.+(POS) C38.+(POS) C39.POS C40.1 C41.1 DMD_PWR.P$2 J35.2 J36.1 PC_POWER_SUPPLY.7 PC_POWER_SUPPLY.11 PC_POWER_SUPPLY.18 PC_POWER_SUPPLY.20
12V: C46.2 C47.2 C48.2 C49.2 C50.2 C51.2 C52.2 C53.2 C54.+(POS) C55.+(POS) C56.POS C57.1 C58.1 INPUT_BANK_0.9 INPUT_BANK_1.9 INPUT_BANK_2.9 INPUT_BANK_3.9 INPUT_BANK_4.9 INPUT_BANK_5.9 INPUT_BANK_6.9 INPUT_BANK_7.9 J35.3 J36.3 PC_POWER_SUPPLY.19
-5V: PC_POWER_SUPPLY.16
-12V: PC_POWER_SUPPLY.4
A_0: ANALOG_0.1 U83.3(A_0)
A_1: ANALOG_1.1 U83.4(A_1)
A_2: ANALOG_2.1 U83.5(A_2)
A_3: ANALOG_3.1 U83.6(A_3)
AUD_L_FILTER: C42.2 C44.1 R177.2
AUD_R_FILTER: C43.2 C45.2 R178.2
AUDIO_L: R177.1 U1.33(P26)
AUDIO_OUT_L: AUDIO.5(T) C42.1
AUDIO_OUT_R: AUDIO.2(R) C43.1
AUDIO_R: R178.1 U1.34(P27)
C0: R47.1 U20.2(C0)
C1: R48.1 U20.4(C1)
C2: R49.1 U20.6(C2)
C3: R50.1 U20.8(C3)
C4: R55.1 U21.2(C0)
C5: R56.1 U21.4(C1)
C6: R57.1 U21.6(C2)
C7: R58.1 U21.8(C3)
C8: R63.1 U22.2(C0)
C9: R64.1 U22.4(C1)
C10: R65.1 U22.6(C2)
C11: R66.1 U22.8(C3)
C12: R71.1 U23.2(C0)
C13: R72.1 U23.4(C1)
C14: R73.1 U23.6(C2)
C15: R74.1 U23.8(C3)
C16: R79.1 U24.2(C0)
C17: R80.1 U24.4(C1)
C18: R81.1 U24.6(C2)
C19: R82.1 U24.8(C3)
C20: R87.1 U25.2(C0)
C21: R88.1 U25.4(C1)
C22: R89.1 U25.6(C2)
C23: R90.1 U25.8(C3)
C24: R95.1 U26.2(C0)
C25: R96.1 U26.4(C1)
C26: R97.1 U26.6(C2)
C27: R98.1 U26.8(C3)
C28: R103.1 U27.2(C0)
C29: R104.1 U27.4(C1)
C30: R105.1 U27.6(C2)
C31: R106.1 U27.8(C3)
C32: R111.1 U28.2(C0)
C33: R112.1 U28.4(C1)
C34: R113.1 U28.6(C2)
C35: R114.1 U28.8(C3)
C36: R119.1 U29.2(C0)
C37: R120.1 U29.4(C1)
C38: R121.1 U29.6(C2)
C39: R122.1 U29.8(C3)
C40: R127.1 U30.2(C0)
C41: R128.1 U30.4(C1)
C42: R129.1 U30.6(C2)
C43: R130.1 U30.8(C3)
C44: R135.1 U31.2(C0)
C45: R136.1 U31.4(C1)
C46: R137.1 U31.6(C2)
C47: R138.1 U31.8(C3)
C48: R143.1 U32.2(C0)
C49: R144.1 U32.4(C1)
C50: R145.1 U32.6(C2)
C51: R146.1 U32.8(C3)
C52: R151.1 U33.2(C0)
C53: R152.1 U33.4(C1)
C54: R153.1 U33.6(C2)
C55: R154.1 U33.8(C3)
C56: R159.1 U34.2(C0)
C57: R160.1 U34.4(C1)
C58: R161.1 U34.6(C2)
C59: R162.1 U34.8(C3)
C60: R167.1 U35.2(C0)
C61: R168.1 U35.4(C1)
C62: R169.1 U35.6(C2)
C63: R170.1 U35.8(C3)
D1: D1.C R1.2
D2: D2.C R2.2
D3: D3.C R3.2
D+: U3.1(I/O1A) USB.3(D+)
D-: U3.6(I/O1B) USB.2(D-)
DATA_CLK: U1.3(P6) U5.12(STCP) U6.12(STCP) U7.12(STCP) U8.12(STCP) U9.2(CLK) U10.2(CLK) U11.2(CLK) U12.2(CLK) U13.2(CLK) U14.2(CLK) U15.2(CLK) U16.2(CLK) U39.12(STCP) U40.12(STCP) U41.12(STCP) U42.12(STCP) U80.4(I/O2B) U81.7(/ST)
DATA_CLK_OUT: AUX.3 U80.6(I/O1B)
DATA_IN: U1.2(P5) U9.9(QH)
DATA_IN1: U9.10(SER) U10.9(QH)
DATA_IN2: U10.10(SER) U11.9(QH)
DATA_IN3: U11.10(SER) U12.9(QH)
DATA_IN4: U12.10(SER) U13.9(QH)
DATA_IN5: U13.10(SER) U14.9(QH)
DATA_IN6: U14.10(SER) U15.9(QH)
DATA_IN7: U15.10(SER) U16.9(QH)
DATA_IN8: U16.10(SER) U79.4(I/O2B)
DATA_IN8_OUT: AUX.5 U79.6(I/O1B)
DATA_LAT: U1.4(P7) U5.11(SHCP) U6.11(SHCP) U7.11(SHCP) U8.11(SHCP) U9.1(LAT) U10.1(LAT) U11.1(LAT) U12.1(LAT) U13.1(LAT) U14.1(LAT) U15.1(LAT) U16.1(LAT) U39.11(SHCP) U40.11(SHCP) U41.11(SHCP) U42.11(SHCP) U80.3(I/O2A)
DATA_LAT_OUT: AUX.2 U80.1(I/O1A)
DATA_OUT: U1.1(P4) U5.14(DS)
DATA_OUT1: U5.9(Q7S) U6.14(DS)
DATA_OUT2: U6.9(Q7S) U7.14(DS)
DATA_OUT3: U7.9(Q7S) U8.14(DS)
DATA_OUT4: U8.9(Q7S) U39.14(DS)
DATA_OUT5: U39.9(Q7S) U40.14(DS)
DATA_OUT6: U40.9(Q7S) U41.14(DS)
DATA_OUT7: U41.9(Q7S) U42.14(DS)
DATA_OUT8: U42.9(Q7S) U79.3(I/O2A)
DATA_OUT8_OUT: AUX.4 U79.1(I/O1A)
DM: R180.2 U3.4(I/O2B)
DMD0: U1.14(P13) U78.3(I/O2A)
DMD1: U1.13(P12) U78.4(I/O2B)
DMD2: U1.12(P11) U77.3(I/O2A)
DMD3: U1.11(P10) U77.4(I/O2B)
DMD4: U1.10(P9) U76.3(I/O2A)
DMD5: U1.9(P8) U76.4(I/O2B)
DMD_OUT0: DMD_CONN.1 U78.1(I/O1A)
DMD_OUT1: DMD_CONN.2 U78.6(I/O1B)
DMD_OUT2: DMD_CONN.3 U77.1(I/O1A)
DMD_OUT3: DMD_CONN.4 U77.6(I/O1B)
DMD_OUT4: DMD_CONN.5 U76.1(I/O1A)
DMD_OUT5: DMD_CONN.6 U76.6(I/O1B)
DP: R181.2 U3.3(I/O2A)
GND: ANALOG_0.2 ANALOG_1.2 ANALOG_2.2 ANALOG_3.2 AUDIO.1(S) AUX.8 AUX.9 AUX.10 AUX.11 AUX.12 AUX.13 AUX.14 C1.2 C2.2 C3.1 C4.1 C5.1 C6.1 C8.1 C9.1 C10.1 C11.1 C12.1 C13.1 C14.1 C15.1 C16.1 C17.1 C18.1 C19.1 C20.1 C21.2 C22.1 C23.1 C24.1 C25.1 C26.1 C27.1 C28.1 C29.1 C30.1 C31.1 C32.-(NEG) C33.-(NEG) C34.NEG C35.2 C36.2 C37.-(NEG) C38.-(NEG) C39.NEG C40.2 C41.2 C44.2 C45.1 C46.1 C47.1 C48.1 C49.1 C50.1 C51.1 C52.1 C53.1 C54.-(NEG) C55.-(NEG) C56.NEG C57.2 C58.2 C59.1 C60.1 C61.1 C65.NEG C66.1 C67.1 C68.1 C69.1 D4.C DMD_CONN.8 DMD_CONN.9 DMD_CONN.10 DMD_CONN.11 DMD_CONN.12 DMD_CONN.13 DMD_CONN.14 DMD_PWR.P$1 PC_POWER_SUPPLY.5 PC_POWER_SUPPLY.6 PC_POWER_SUPPLY.9 PC_POWER_SUPPLY.10 PC_POWER_SUPPLY.12 PC_POWER_SUPPLY.13 PC_POWER_SUPPLY.14 R1.1 R12.2 R13.2 R14.2 R15.1 R16.1 R17.1 R18.1 R19.1 R20.1 R21.1 R22.1 R23.1 R24.1 R25.1 R26.1 R27.1 R28.1 R29.1 R30.1 R31.1 R32.1 R33.1 R34.1 R35.1 R36.1 R37.1 R38.1 R39.1 R40.1 R41.1 R42.1 R43.1 R44.1 R45.1 R46.1 R47.2 R48.2 R49.2 R50.2 R51.1 R52.1 R53.1 R54.1 R55.2 R56.2 R57.2 R58.2 R59.1 R60.1 R61.1 R62.1 R63.2 R64.2 R65.2 R66.2 R67.1 R68.1 R69.1 R70.1 R71.2 R72.2 R73.2 R74.2 R75.1 R76.1 R77.1 R78.1 R79.2 R80.2 R81.2 R82.2 R83.1 R84.1 R85.1 R86.1 R87.2 R88.2 R89.2 R90.2 R91.1 R92.1 R93.1 R94.1 R95.2 R96.2 R97.2 R98.2 R99.1 R100.1 R101.1 R102.1 R103.2 R104.2 R105.2 R106.2 R107.1 R108.1 R109.1 R110.1 R111.2 R112.2 R113.2 R114.2 R115.1 R116.1 R117.1 R118.1 R119.2 R120.2 R121.2 R122.2 R123.1 R124.1 R125.1 R126.1 R127.2 R128.2 R129.2 R130.2 R131.1 R132.1 R133.1 R134.1 R135.2 R136.2 R137.2 R138.2 R139.1 R140.1 R141.1 R142.1 R143.2 R144.2 R145.2 R146.2 R147.1 R148.1 R149.1 R150.1 R151.2 R152.2 R153.2 R154.2 R155.1 R156.1 R157.1 R158.1 R159.2 R160.2 R161.2 R162.2 R163.1 R164.1 R165.1 R166.1 R167.2 R168.2 R169.2 R170.2 R171.1 R172.1 R173.1 R174.1 R175.2 R179.2 R182.2 R183.2 R187.1 R189.2 RESET.1(A) RGB_CONN.3 SD1.3(GND) SD1.SHIELD0(GND) SD1.SHIELD1(GND) SD1.SHIELD2(GND) SD1.SHIELD3(GND) SEG1.1(COM) SEG1.6(COM) SEG2.1(COM) SEG2.6(COM) SEG3.1(COM) SEG3.6(COM) SERVO_0.3 SERVO_1.3 SERVO_2.3 SERVO_3.3 SERVO_4.3 SERVO_5.3 SERVO_6.3 SERVO_7.3 SERVO_EXT_PWR.P$1 SW2.1 U1.5(VSS) U1.6(BOE') U1.17(VSS) U1.27(VSS) U1.39(VSS) U2.5(GND) U2.13(GND) U3.2(GND) U4.2(A1) U4.3(A2) U4.4(GND) U4.7(WP) U5.8(GND) U6.8(GND) U7.8(GND) U8.8(GND) U9.8(GND) U9.15(C_INH) U10.8(GND) U10.15(C_INH) U11.8(GND) U11.15(C_INH) U12.8(GND) U12.15(C_INH) U13.8(GND) U13.15(C_INH) U14.8(GND) U14.15(C_INH) U15.8(GND) U15.15(C_INH) U16.8(GND) U16.15(C_INH) U17.1(GND) U18.1(GND) U19.1(GND) U36.1(CS') U36.4(GND) U37.1(CS') U37.4(GND) U38.1(GND) U39.8(GND) U40.8(GND) U41.8(GND) U42.8(GND) U75.2(GND) U76.2(GND) U77.2(GND) U78.2(GND) U79.2(GND) U80.2(GND) U81.4(GND) U82.2(GND) U83.7(GND) U84.2(EMITTER) USB.5(GND) USB.S1(GND) USB.S2(GND) USB.S3(GND) USB.S4(GND)
IN0: R51.2 U9.11(D0) U20.15(E0)
IN1: R52.2 U9.12(D1) U20.13(E1)
IN2: R53.2 U9.13(D2) U20.11(E2)
IN3: R54.2 U9.14(D3) U20.9(E3)
IN4: R59.2 U9.3(D4) U21.15(E0)
IN5: R60.2 U9.4(D5) U21.13(E1)
IN6: R61.2 U9.5(D6) U21.11(E2)
IN7: R62.2 U9.6(D7) U21.9(E3)
IN8: R67.2 U10.11(D0) U22.15(E0)
IN9: R68.2 U10.12(D1) U22.13(E1)
IN10: R69.2 U10.13(D2) U22.11(E2)
IN11: R70.2 U10.14(D3) U22.9(E3)
IN12: R75.2 U10.3(D4) U23.15(E0)
IN13: R76.2 U10.4(D5) U23.13(E1)
IN14: R77.2 U10.5(D6) U23.11(E2)
IN15: R78.2 U10.6(D7) U23.9(E3)
IN16: R83.2 U11.11(D0) U24.15(E0)
IN17: R84.2 U11.12(D1) U24.13(E1)
IN18: R85.2 U11.13(D2) U24.11(E2)
IN19: R86.2 U11.14(D3) U24.9(E3)
IN20: R91.2 U11.3(D4) U25.15(E0)
IN21: R92.2 U11.4(D5) U25.13(E1)
IN22: R93.2 U11.5(D6) U25.11(E2)
IN23: R94.2 U11.6(D7) U25.9(E3)
IN24: R99.2 U12.11(D0) U26.15(E0)
IN25: R100.2 U12.12(D1) U26.13(E1)
IN26: R101.2 U12.13(D2) U26.11(E2)
IN27: R102.2 U12.14(D3) U26.9(E3)
IN28: R107.2 U12.3(D4) U27.15(E0)
IN29: R108.2 U12.4(D5) U27.13(E1)
IN30: R109.2 U12.5(D6) U27.11(E2)
IN31: R110.2 U12.6(D7) U27.9(E3)
IN32: R115.2 U13.11(D0) U28.15(E0)
IN33: R116.2 U13.12(D1) U28.13(E1)
IN34: R117.2 U13.13(D2) U28.11(E2)
IN35: R118.2 U13.14(D3) U28.9(E3)
IN36: R123.2 U13.3(D4) U29.15(E0)
IN37: R124.2 U13.4(D5) U29.13(E1)
IN38: R125.2 U13.5(D6) U29.11(E2)
IN39: R126.2 U13.6(D7) U29.9(E3)
IN40: R131.2 U14.11(D0) U30.15(E0)
IN41: R132.2 U14.12(D1) U30.13(E1)
IN42: R133.2 U14.13(D2) U30.11(E2)
IN43: R134.2 U14.14(D3) U30.9(E3)
IN44: R139.2 U14.3(D4) U31.15(E0)
IN45: R140.2 U14.4(D5) U31.13(E1)
IN46: R141.2 U14.5(D6) U31.11(E2)
IN47: R142.2 U14.6(D7) U31.9(E3)
IN48: R147.2 U15.11(D0) U32.15(E0)
IN49: R148.2 U15.12(D1) U32.13(E1)
IN50: R149.2 U15.13(D2) U32.11(E2)
IN51: R150.2 U15.14(D3) U32.9(E3)
IN52: R155.2 U15.3(D4) U33.15(E0)
IN53: R156.2 U15.4(D5) U33.13(E1)
IN54: R157.2 U15.5(D6) U33.11(E2)
IN55: R158.2 U15.6(D7) U33.9(E3)
IN56: R163.2 U16.11(D0) U34.15(E0)
IN57: R164.2 U16.12(D1) U34.13(E1)
IN58: R165.2 U16.13(D2) U34.11(E2)
IN59: R166.2 U16.14(D3) U34.9(E3)
IN60: R171.2 U16.3(D4) U35.15(E0)
IN61: R172.2 U16.4(D5) U35.13(E1)
IN62: R173.2 U16.5(D6) U35.11(E2)
IN63: R174.2 U16.6(D7) U35.9(E3)
INPUT0: INPUT_BANK_0.1 U20.1(A0)
INPUT1: INPUT_BANK_0.2 U20.3(A1)
INPUT2: INPUT_BANK_0.3 U20.5(A2)
INPUT3: INPUT_BANK_0.4 U20.7(A3)
INPUT4: INPUT_BANK_0.5 U21.1(A0)
INPUT5: INPUT_BANK_0.6 U21.3(A1)
INPUT6: INPUT_BANK_0.7 U21.5(A2)
INPUT7: INPUT_BANK_0.8 U21.7(A3)
INPUT8: INPUT_BANK_1.1 U22.1(A0)
INPUT9: INPUT_BANK_1.2 U22.3(A1)
INPUT10: INPUT_BANK_1.3 U22.5(A2)
INPUT11: INPUT_BANK_1.4 U22.7(A3)
INPUT12: INPUT_BANK_1.5 U23.1(A0)
INPUT13: INPUT_BANK_1.6 U23.3(A1)
INPUT14: INPUT_BANK_1.7 U23.5(A2)
INPUT15: INPUT_BANK_1.8 U23.7(A3)
INPUT16: INPUT_BANK_2.1 U24.1(A0)
INPUT17: INPUT_BANK_2.2 U24.3(A1)
INPUT18: INPUT_BANK_2.3 U24.5(A2)
INPUT19: INPUT_BANK_2.4 U24.7(A3)
INPUT20: INPUT_BANK_2.5 U25.1(A0)
INPUT21: INPUT_BANK_2.6 U25.3(A1)
INPUT22: INPUT_BANK_2.7 U25.5(A2)
INPUT23: INPUT_BANK_2.8 U25.7(A3)
INPUT24: INPUT_BANK_3.1 U26.1(A0)
INPUT25: INPUT_BANK_3.2 U26.3(A1)
INPUT26: INPUT_BANK_3.3 U26.5(A2)
INPUT27: INPUT_BANK_3.4 U26.7(A3)
INPUT28: INPUT_BANK_3.5 U27.1(A0)
INPUT29: INPUT_BANK_3.6 U27.3(A1)
INPUT30: INPUT_BANK_3.7 U27.5(A2)
INPUT31: INPUT_BANK_3.8 U27.7(A3)
INPUT32: INPUT_BANK_4.1 U28.1(A0)
INPUT33: INPUT_BANK_4.2 U28.3(A1)
INPUT34: INPUT_BANK_4.3 U28.5(A2)
INPUT35: INPUT_BANK_4.4 U28.7(A3)
INPUT36: INPUT_BANK_4.5 U29.1(A0)
INPUT37: INPUT_BANK_4.6 U29.3(A1)
INPUT38: INPUT_BANK_4.7 U29.5(A2)
INPUT39: INPUT_BANK_4.8 U29.7(A3)
INPUT40: INPUT_BANK_5.1 U30.1(A0)
INPUT41: INPUT_BANK_5.2 U30.3(A1)
INPUT42: INPUT_BANK_5.3 U30.5(A2)
INPUT43: INPUT_BANK_5.4 U30.7(A3)
INPUT44: INPUT_BANK_5.5 U31.1(A0)
INPUT45: INPUT_BANK_5.6 U31.3(A1)
INPUT46: INPUT_BANK_5.7 U31.5(A2)
INPUT47: INPUT_BANK_5.8 U31.7(A3)
INPUT48: INPUT_BANK_6.1 U32.1(A0)
INPUT49: INPUT_BANK_6.2 U32.3(A1)
INPUT50: INPUT_BANK_6.3 U32.5(A2)
INPUT51: INPUT_BANK_6.4 U32.7(A3)
INPUT52: INPUT_BANK_6.5 U33.1(A0)
INPUT53: INPUT_BANK_6.6 U33.3(A1)
INPUT54: INPUT_BANK_6.7 U33.5(A2)
INPUT55: INPUT_BANK_6.8 U33.7(A3)
INPUT56: INPUT_BANK_7.1 U34.1(A0)
INPUT57: INPUT_BANK_7.2 U34.3(A1)
INPUT58: INPUT_BANK_7.3 U34.5(A2)
INPUT59: INPUT_BANK_7.4 U34.7(A3)
INPUT60: INPUT_BANK_7.5 U35.1(A0)
INPUT61: INPUT_BANK_7.6 U35.3(A1)
INPUT62: INPUT_BANK_7.7 U35.5(A2)
INPUT63: INPUT_BANK_7.8 U35.7(A3)
IREF0: R12.1 U17.3(IREF)
IREF1: R13.1 U18.3(IREF)
IREF2: R14.1 U19.3(IREF)
IREF3: R175.1 U38.3(IREF)
IRQ: R6.1 SD1.1(IRQ)
LED0: LIGHT_BANK_0.1 U17.6(OUT0)
LED1: LIGHT_BANK_0.2 U17.7(OUT1)
LED2: LIGHT_BANK_0.3 U17.8(OUT2)
LED3: LIGHT_BANK_0.4 U17.9(OUT3)
LED4: LIGHT_BANK_0.5 U17.10(OUT4)
LED5: LIGHT_BANK_0.6 U17.11(OUT5)
LED6: LIGHT_BANK_0.7 U17.12(OUT6)
LED7: LIGHT_BANK_0.8 U17.13(OUT7)
LED8: LIGHT_BANK_0.9 U17.14(OUT8)
LED9: LIGHT_BANK_1.9 U17.15(OUT9)
LED10: LIGHT_BANK_1.8 U17.16(OUT10)
LED11: LIGHT_BANK_1.7 U17.17(OUT11)
LED12: LIGHT_BANK_1.6 U17.18(OUT12)
LED13: LIGHT_BANK_1.5 U17.19(OUT13)
LED14: LIGHT_BANK_1.4 U17.20(OUT14)
LED15: LIGHT_BANK_1.3 U17.21(OUT15)
LED16: LIGHT_BANK_1.2 U17.22(OUT16)
LED17: LIGHT_BANK_1.1 U17.23(OUT17)
LED18: LIGHT_BANK_2.1 U18.6(OUT0)
LED19: LIGHT_BANK_2.2 U18.7(OUT1)
LED20: LIGHT_BANK_2.3 U18.8(OUT2)
LED21: LIGHT_BANK_2.4 U18.9(OUT3)
LED22: LIGHT_BANK_2.5 U18.10(OUT4)
LED23: LIGHT_BANK_2.6 U18.11(OUT5)
LED24: LIGHT_BANK_2.7 U18.12(OUT6)
LED25: LIGHT_BANK_2.8 U18.13(OUT7)
LED26: LIGHT_BANK_2.9 U18.14(OUT8)
LED27: LIGHT_BANK_3.9 U18.15(OUT9)
LED28: LIGHT_BANK_3.8 U18.16(OUT10)
LED29: LIGHT_BANK_3.7 U18.17(OUT11)
LED30: LIGHT_BANK_3.6 U18.18(OUT12)
LED31: LIGHT_BANK_3.5 U18.19(OUT13)
LED32: LIGHT_BANK_3.4 U18.20(OUT14)
LED33: LIGHT_BANK_3.3 U18.21(OUT15)
LED34: LIGHT_BANK_3.2 U18.22(OUT16)
LED35: LIGHT_BANK_3.1 U18.23(OUT17)
LED36: LIGHT_BANK_4.1 U19.6(OUT0)
LED37: LIGHT_BANK_4.2 U19.7(OUT1)
LED38: LIGHT_BANK_4.3 U19.8(OUT2)
LED39: LIGHT_BANK_4.4 U19.9(OUT3)
LED40: LIGHT_BANK_4.5 U19.10(OUT4)
LED41: LIGHT_BANK_4.6 U19.11(OUT5)
LED42: LIGHT_BANK_4.7 U19.12(OUT6)
LED43: LIGHT_BANK_4.8 U19.13(OUT7)
LED44: LIGHT_BANK_4.9 U19.14(OUT8)
LED45: LIGHT_BANK_5.9 U19.15(OUT9)
LED46: LIGHT_BANK_5.8 U19.16(OUT10)
LED47: LIGHT_BANK_5.7 U19.17(OUT11)
LED48: LIGHT_BANK_5.6 U19.18(OUT12)
LED49: LIGHT_BANK_5.5 U19.19(OUT13)
LED50: LIGHT_BANK_5.4 U19.20(OUT14)
LED51: LIGHT_BANK_5.3 U19.21(OUT15)
LED52: LIGHT_BANK_5.2 U19.22(OUT16)
LED53: LIGHT_BANK_5.1 U19.23(OUT17)
LED54: LIGHT_BANK_6.1 U38.6(OUT0)
LED55: LIGHT_BANK_6.2 U38.7(OUT1)
LED56: LIGHT_BANK_6.3 U38.8(OUT2)
LED57: LIGHT_BANK_6.4 U38.9(OUT3)
LED58: LIGHT_BANK_6.5 U38.10(OUT4)
LED59: LIGHT_BANK_6.6 U38.11(OUT5)
LED60: LIGHT_BANK_6.7 U38.12(OUT6)
LED61: LIGHT_BANK_6.8 U38.13(OUT7)
LED62: LIGHT_BANK_6.9 U38.14(OUT8)
LED63: LIGHT_BANK_7.9 U38.15(OUT9)
LED64: LIGHT_BANK_7.8 U38.16(OUT10)
LED65: LIGHT_BANK_7.7 U38.17(OUT11)
LED66: LIGHT_BANK_7.6 U38.18(OUT12)
LED67: LIGHT_BANK_7.5 U38.19(OUT13)
LED68: LIGHT_BANK_7.4 U38.20(OUT14)
LED69: LIGHT_BANK_7.3 U38.21(OUT15)
LED70: LIGHT_BANK_7.2 U38.22(OUT16)
LED71: LIGHT_BANK_7.1 U38.23(OUT17)
LED_CK0: U1.32(P25) U17.4(CKI)
LED_CK1: U17.25(CKO) U18.4(CKI)
LED_CK2: U18.25(CKO) U19.4(CKI)
LED_CK3: U19.25(CKO) U38.4(CKI)
LED_CK4: U38.25(CKO) U82.3(I/O2A)
LED_CK4_OUT: RGB_CONN.1 U82.1(I/O1A)
LED_SD0: U1.31(P24) U17.5(SDI)
LED_SD1: U17.24(SDO) U18.5(SDI)
LED_SD2: U18.24(SDO) U19.5(SDI)
LED_SD3: U19.24(SDO) U38.5(SDI)
LED_SD4: U38.24(SDO) U82.4(I/O2B)
LED_SD4_OUT: RGB_CONN.2 U82.6(I/O1B)
N$1: R188.2 U84.1(BASE)
N$2: D5.C R187.2
OUT0: R16.2 S0.G(GATE) U5.15(Q0)
OUT1: R15.2 S1.G(GATE) U5.1(Q1)
OUT2: R18.2 S2.G(GATE) U5.2(Q2)
OUT3: R17.2 S3.G(GATE) U5.3(Q3)
OUT4: R20.2 S4.G(GATE) U5.4(Q4)
OUT5: R19.2 S5.G(GATE) U5.5(Q5)
OUT6: R22.2 S6.G(GATE) U5.6(Q6)
OUT7: R21.2 S7.G(GATE) U5.7(Q7)
OUT8: R24.2 S8.G(GATE) U6.15(Q0)
OUT9: R23.2 S9.G(GATE) U6.1(Q1)
OUT10: R26.2 S10.G(GATE) U6.2(Q2)
OUT11: R25.2 S11.G(GATE) U6.3(Q3)
OUT12: R28.2 S12.G(GATE) U6.4(Q4)
OUT13: R27.2 S13.G(GATE) U6.5(Q5)
OUT14: R30.2 S14.G(GATE) U6.6(Q6)
OUT15: R29.2 S15.G(GATE) U6.7(Q7)
OUT16: R32.2 S16.G(GATE) U7.15(Q0)
OUT17: R31.2 S17.G(GATE) U7.1(Q1)
OUT18: R34.2 S18.G(GATE) U7.2(Q2)
OUT19: R33.2 S19.G(GATE) U7.3(Q3)
OUT20: R36.2 S20.G(GATE) U7.4(Q4)
OUT21: R35.2 S21.G(GATE) U7.5(Q5)
OUT22: R38.2 S22.G(GATE) U7.6(Q6)
OUT23: R37.2 S23.G(GATE) U7.7(Q7)
OUT24: R40.2 S24.G(GATE) U8.15(Q0)
OUT25: R39.2 S25.G(GATE) U8.1(Q1)
OUT26: R42.2 S26.G(GATE) U8.2(Q2)
OUT27: R41.2 S27.G(GATE) U8.3(Q3)
OUT28: R44.2 S28.G(GATE) U8.4(Q4)
OUT29: R43.2 S29.G(GATE) U8.5(Q5)
OUT30: R46.2 S30.G(GATE) U8.6(Q6)
OUT31: R45.2 S31.G(GATE) U8.7(Q7)
OUTPUT_00: OUTPUT_BANK_0.P$1 S0.D(DRAIN)
OUTPUT_01: OUTPUT_BANK_0.P$2 S1.D(DRAIN)
OUTPUT_02: OUTPUT_BANK_0.P$3 S2.D(DRAIN)
OUTPUT_03: OUTPUT_BANK_0.P$4 S3.D(DRAIN)
OUTPUT_04: OUTPUT_BANK_0.P$5 S4.D(DRAIN)
OUTPUT_05: OUTPUT_BANK_0.P$6 S5.D(DRAIN)
OUTPUT_06: OUTPUT_BANK_0.P$7 S6.D(DRAIN)
OUTPUT_07: OUTPUT_BANK_0.P$8 S7.D(DRAIN)
OUTPUT_08: OUTPUT_BANK_1.P$1 S8.D(DRAIN)
OUTPUT_09: OUTPUT_BANK_1.P$2 S9.D(DRAIN)
OUTPUT_10: OUTPUT_BANK_1.P$3 S10.D(DRAIN)
OUTPUT_11: OUTPUT_BANK_1.P$4 S11.D(DRAIN)
OUTPUT_12: OUTPUT_BANK_1.P$5 S12.D(DRAIN)
OUTPUT_13: OUTPUT_BANK_1.P$6 S13.D(DRAIN)
OUTPUT_14: OUTPUT_BANK_1.P$7 S14.D(DRAIN)
OUTPUT_15: OUTPUT_BANK_1.P$8 S15.D(DRAIN)
OUTPUT_16: OUTPUT_BANK_2.P$1 S16.D(DRAIN)
OUTPUT_17: OUTPUT_BANK_2.P$2 S17.D(DRAIN)
OUTPUT_18: OUTPUT_BANK_2.P$3 S18.D(DRAIN)
OUTPUT_19: OUTPUT_BANK_2.P$4 S19.D(DRAIN)
OUTPUT_20: OUTPUT_BANK_2.P$5 S20.D(DRAIN)
OUTPUT_21: OUTPUT_BANK_2.P$6 S21.D(DRAIN)
OUTPUT_22: OUTPUT_BANK_2.P$7 S22.D(DRAIN)
OUTPUT_23: OUTPUT_BANK_2.P$8 S23.D(DRAIN)
OUTPUT_24: OUTPUT_BANK_3.P$1 S24.D(DRAIN)
OUTPUT_25: OUTPUT_BANK_3.P$2 S25.D(DRAIN)
OUTPUT_26: OUTPUT_BANK_3.P$3 S26.D(DRAIN)
OUTPUT_27: OUTPUT_BANK_3.P$4 S27.D(DRAIN)
OUTPUT_28: OUTPUT_BANK_3.P$5 S28.D(DRAIN)
OUTPUT_29: OUTPUT_BANK_3.P$6 S29.D(DRAIN)
OUTPUT_30: OUTPUT_BANK_3.P$7 S30.D(DRAIN)
OUTPUT_31: OUTPUT_BANK_3.P$8 S31.D(DRAIN)
OUTPUT_EN: R179.1 U5.13(OE) U6.13(OE) U7.13(OE) U8.13(OE) U39.13(OE) U40.13(OE) U41.13(OE) U42.13(OE) U81.5(RST)
PWR_EN: PC_POWER_SUPPLY.8 SW2.2
PWR_LED: D4.A R186.1
RELAY_PWR_DRAIN: D5.A EM1.5 U84.3(COLLECTOR)
RES: C7.2 R176.1 RESET.2(B) U1.7(RES')
RTS: C7.1 U2.2(RTS#)
RW: R11.1 SD1.8(RW)
RX: U1.37(P30) U2.4(RXD)
RXLED: R2.1 U2.14(CBUS1)
SCL: R4.1 U1.35(P28) U4.6(SCL) U75.4(I/O2B) U83.1(SCL)
SCL_OUT: AUX.7 U75.6(I/O1B)
SD_CS: R10.1 SD1.7(CS) U1.44(P3)
SD_DI: R9.1 SD1.6(DI) U1.43(P2)
SD_DO: R7.1 SD1.2(D0) U1.41(P0)
SD_SCLK: R8.1 SD1.4(SCLK) U1.42(P1)
SDA: R5.1 U1.36(P29) U4.5(SDA) U75.3(I/O2A) U83.2(SDA)
SDA_OUT: AUX.6 U75.1(I/O1A)
SEG0: SEG1.10(A) U40.15(Q0)
SEG1: SEG1.9(B) U40.1(Q1)
SEG2: SEG1.8(C) U40.3(Q3)
SEG3: SEG1.5(D) U40.7(Q7)
SEG4: SEG1.4(E) U40.6(Q6)
SEG5: SEG1.2(F) U40.4(Q4)
SEG6: SEG1.3(G) U40.5(Q5)
SEG7: SEG1.7(DP) U40.2(Q2)
SEG8: SEG2.10(A) U41.15(Q0)
SEG9: SEG2.9(B) U41.1(Q1)
SEG10: SEG2.8(C) U41.3(Q3)
SEG11: SEG2.5(D) U41.7(Q7)
SEG12: SEG2.4(E) U41.6(Q6)
SEG13: SEG2.2(F) U41.4(Q4)
SEG14: SEG2.3(G) U41.5(Q5)
SEG15: SEG2.7(DP) U41.2(Q2)
SEG16: SEG3.10(A) U42.15(Q0)
SEG17: SEG3.9(B) U42.1(Q1)
SEG18: SEG3.8(C) U42.3(Q3)
SEG19: SEG3.5(D) U42.7(Q7)
SEG20: SEG3.4(E) U42.6(Q6)
SEG21: SEG3.2(F) U42.4(Q4)
SEG22: SEG3.3(G) U42.5(Q5)
SERVO_0: SERVO_0.1 U39.15(Q0)
SERVO_1: SERVO_1.1 U39.1(Q1)
SERVO_2: SERVO_2.1 U39.2(Q2)
SERVO_3: SERVO_3.1 U39.3(Q3)
SERVO_4: SERVO_4.1 U39.4(Q4)
SERVO_5: SERVO_5.1 U39.5(Q5)
SERVO_6: SERVO_6.1 U39.6(Q6)
SERVO_7: SERVO_7.1 U39.7(Q7)
SERVO_EXT: J36.2 SERVO_EXT_PWR.P$2
SERVO_PWR: C65.POS J36.OUT SERVO_0.2 SERVO_1.2 SERVO_2.2 SERVO_3.2 SERVO_4.2 SERVO_5.2 SERVO_6.2 SERVO_7.2
SIO_0: U1.19(P16) U36.5(SI/SIO0)
SIO_1: U1.20(P17) U36.2(SO/SIO1)
SIO_2: U1.21(P18) U36.3(SIO2)
SIO_3: U1.22(P19) U36.7(SIO3)
SIO_4: U1.23(P20) U37.5(SI/SIO0)
SIO_5: U1.24(P21) U37.2(SO/SIO1)
SIO_6: U1.25(P22) U37.3(SIO2)
SIO_7: U1.26(P23) U37.7(SIO3)
SOL_PWR_RELAY: EM1.3 FUSE.1A FUSE.1B
SOL_PWR_RELAY_CTRL: R188.1 R189.1 SEG3.7(DP) U42.2(Q2)
SOLENOID_GND: C62.N(NEG) C63.N(NEG) C64.N(NEG) R182.1 R183.1 S0.S(SOURCE) S1.S(SOURCE) S2.S(SOURCE) S3.S(SOURCE) S4.S(SOURCE) S5.S(SOURCE) S6.S(SOURCE) S7.S(SOURCE) S8.S(SOURCE) S9.S(SOURCE) S10.S(SOURCE) S11.S(SOURCE) S12.S(SOURCE) S13.S(SOURCE) S14.S(SOURCE) S15.S(SOURCE) S16.S(SOURCE) S17.S(SOURCE) S18.S(SOURCE) S19.S(SOURCE) S20.S(SOURCE) S21.S(SOURCE) S22.S(SOURCE) S23.S(SOURCE) S24.S(SOURCE) S25.S(SOURCE) S26.S(SOURCE) S27.S(SOURCE) S28.S(SOURCE) S29.S(SOURCE) S30.S(SOURCE) S31.S(SOURCE) SOLENOID_PWR.2 SOLENOID_PWR.3
SOLENOID_PWR: C62.P(POS) C63.P(POS) C64.P(POS) EM1.1 OUTPUT_BANK_0.P$9 OUTPUT_BANK_1.P$9 OUTPUT_BANK_2.P$9 OUTPUT_BANK_3.P$9
SOLENOID_PWR_IN: FUSE.2A FUSE.2B SOLENOID_PWR.1 SOLENOID_PWR.4
SRAM_CLK_0: U1.15(P14) U36.6(SCK)
SRAM_CLK_1: U1.16(P15) U37.6(SCK)
TX: U1.38(P31) U2.1(TXD)
TXLED: R3.1 U2.7(CBUS2)
USBDM: R180.1 U2.9(USBDM)
USBDP: R181.1 U2.8(USBDP)
V_LED: C66.2 C67.2 C68.2 C69.2 J35.OUT LIGHT_BANK_0.10 LIGHT_BANK_1.10 LIGHT_BANK_2.10 LIGHT_BANK_3.10 LIGHT_BANK_4.10 LIGHT_BANK_5.10 LIGHT_BANK_6.10 LIGHT_BANK_7.10
VBUS: C1.1 D1.A D2.A D3.A U2.12(VCC) U3.5(VB) USB.1(5V)
X0: U1.29(X0) X1.1
X1: U1.28(X1) X1.3
Unconnected: DMD_CONN.7 EM1.4 PC_POWER_SUPPLY.15 PC_POWER_SUPPLY.17 SW2.3 U2.6(CTS#) U2.15(CBUS0) U2.16(CBUS3) U9.7(QH') U10.7(QH') U11.7(QH') U12.7(QH') U13.7(QH') U14.7(QH') U15.7(QH') U16.7(QH') U81.1(/PB) U81.6(/RST) USB.4(ID)

## Library data of the parts
ANALOG_0 ANALOG_1-ANALOG_3 SERVO_0 SERVO_1-SERVO_7 = PP_Connectors:PH_1X03: 3 pin connectors
AUDIO = PP_Connectors:TRS_JACK: TRS Jacks
AUX DMD_CONN = PP_Connectors:PH_2X07
C1-C31 C35 C36 C40-C53 C57-C61 C66-C69 = PP_Passives:CAPACITOR_NON_POLAR: Capacitor Non Polarized
C32-C34 C37-C39 C54-C56 C62-C65 = PP_Passives:CAPACITOR_POLARIZED: Polarized capacitors
D1-D5 = led:LED: LED OSRAM: - CHIPLED LG R971, LG N971, LY N971, LG Q971, LY Q971, LO R971, LY R971 LH N974, LH R974 LS Q976, LO Q976, LY Q976 LO Q996 - Hyper CHIPLED LW Q18S LB Q993, LB Q99A, LB R99A - SideLED LS A670, LO A670, LY A670, LG A670, LP A670 LB A673, LV A673, LT A673, LW A673 LH A674 LY A675 LS A676, LA A676, LO A676, LY A676, LW A676 LS A679, LY A679, LG A679 - Hyper Micro SIDELED® LS Y876, LA Y876, LO Y876, LY Y876 LT Y87S - SmartLED LW L88C, LW L88S LB L89C, LB L89S, LG L890 LS L89K, LO L89K, LY L89K LS L896, LA L896, LO L896, LY L896 - TOPLED LS T670, LO T670, LY T670, LG T670, LP T670 LSG T670, LSP T670, LSY T670, LOP T670, LYG T670 LG T671, LOG T671, LSG T671 LB T673, LV T673, LT T673, LW T673 LH T674 LS T676, LA T676, LO T676, LY T676, LB T676, LH T676, LSB T676, LW T676 LB T67C, LV T67C, LT T67C, LS T67K, LO T67K, LY T67K, LW E67C LS E67B, LA E67B, LO E67B, LY E67B, LB E67C, LV E67C, LT E67C LW T67C LS T679, LY T679, LG T679 LS T770, LO T770, LY T770, LG T770, LP T770 LB T773, LV T773, LT T773, LW T773 LH T774 LS E675, LA E675, LY E675, LS T675 LS T776, LA T776, LO T776, LY T776, LB T776 LHGB T686 LT T68C, LB T68C - Hyper Mini TOPLED® LB M676 - Mini TOPLED Santana® LG M470 LS M47K, LO M47K, LY M47K Source: http://www.osram.convergy.de LUXEON: - LUMILED® LXK2-PW12-R00, LXK2-PW12-S00, LXK2-PW14-U00, LXK2-PW14-V00 LXK2-PM12-R00, LXK2-PM12-S00, LXK2-PM14-U00 LXK2-PE12-Q00, LXK2-PE12-R00, LXK2-PE12-S00, LXK2-PE14-T00, LXK2-PE14-U00 LXK2-PB12-K00, LXK2-PB12-L00, LXK2-PB12-M00, LXK2-PB14-N00, LXK2-PB14-P00, LXK2-PB14-Q00 LXK2-PR12-L00, LXK2-PR12-M00, LXK2-PR14-Q00, LXK2-PR14-R00 LXK2-PD12-Q00, LXK2-PD12-R00, LXK2-PD12-S00 LXK2-PH12-R00, LXK2-PH12-S00 LXK2-PL12-P00, LXK2-PL12-Q00, LXK2-PL12-R00 Source: www.luxeon.com KINGBRIGHT: KA-3528ASYC Source: www.kingbright.com
DMD_PWR SERVO_EXT_PWR = PP_Connectors:PH_1X02: 2 pin connectors
EM1 = PP_Electromechanical:SPDT_RELAY
FUSE = PP_Passives:PTC_FUSE
INPUT_BANK_0 INPUT_BANK_1-INPUT_BANK_7 OUTPUT_BANK_0 OUTPUT_BANK_1-OUTPUT_BANK_3 = PP_Connectors:PH_1X09
J35 J36 = PP_Connectors:ROYS_VOLTAGE_CHOOSER
LIGHT_BANK_0 LIGHT_BANK_1-LIGHT_BANK_7 = PP_Connectors:PH_1X10
PC_POWER_SUPPLY = PP_Connectors:PH_2X10
R1-R183 R186-R189 = PP_Passives:RESISTOR: Resistors
RESET = PP_Electromechanical:SPST: SPST Switches
RGB_CONN SOLENOID_PWR = PP_Connectors:PH_1X04: 4 Pin Connectors
S0 S1-S31 = PP_DiscreteSemi:MOSFET_N-CHANNEL_SINGLE: Mosfet - N-Channel - Single
SD1 = PP_Connectors:SD_CARD
SEG1-SEG3 = PP_LED:7-SEGMENT_SINGLE
SW2 = PP_Electromechanical:SPDT
U1 = PP_DigitalIC:P8X32A_PROPELLER
U2 = PP_DigitalIC:FT230X: Manufacturer Part #: FT230XS-R Manufacturer: FTDI Description: USB Interface IC USB to Basic Serial UART IC SSOP-16
U3 U75-U80 U82 = PP_Passives:IP4234CZ6: Mouser Part #: 771-IP4234CZ6125 Manufacturer Part #: IP4234CZ6,125 Manufacturer: NXP Semiconductors Description: ESD Suppressors Single USB 2.0 ESD Protection 6-Pin http://www.mouser.com/ProductDetail/NXP-Semiconductors/IP4234CZ6125/?qs=sGAEpiMZZMvxHShE6Whpu7QUdHOfUl1T0xbl582qhFk%3d
U4 = PP_DigitalIC:CAT24M01XI-T2
U5-U8 U39-U42 = PP_DigitalIC:74HC595
U9-U16 = PP_DigitalIC:74HC165
U17-U19 U38 = PP_DigitalIC:WS2803
U20-U35 = PP_DigitalIC:TCMT4100
U36 U37 = PP_DigitalIC:23A1024/23LC1024
U81 = PP_FreqCtrl:MIC1232MY
U83 = PP_DigitalIC:AD799X
U84 = PP_DiscreteSemi:BJT_NPN_SINGLE: BJT NPN - Single
U$1 = PP_Aesthetics:LHE_FRAME; DNAME: Parker Dillmann; PNAME: Main_Board_Tommy_System; REVNUM: REV 1
USB = PP_Connectors:USB
X1 = PP_FreqCtrl:CRYSTAL